# EAGLE design LineBot_2016 (EAGLE 7.4.0)

## Sheet 1 of 9: Spannungsversorgung 3,3V
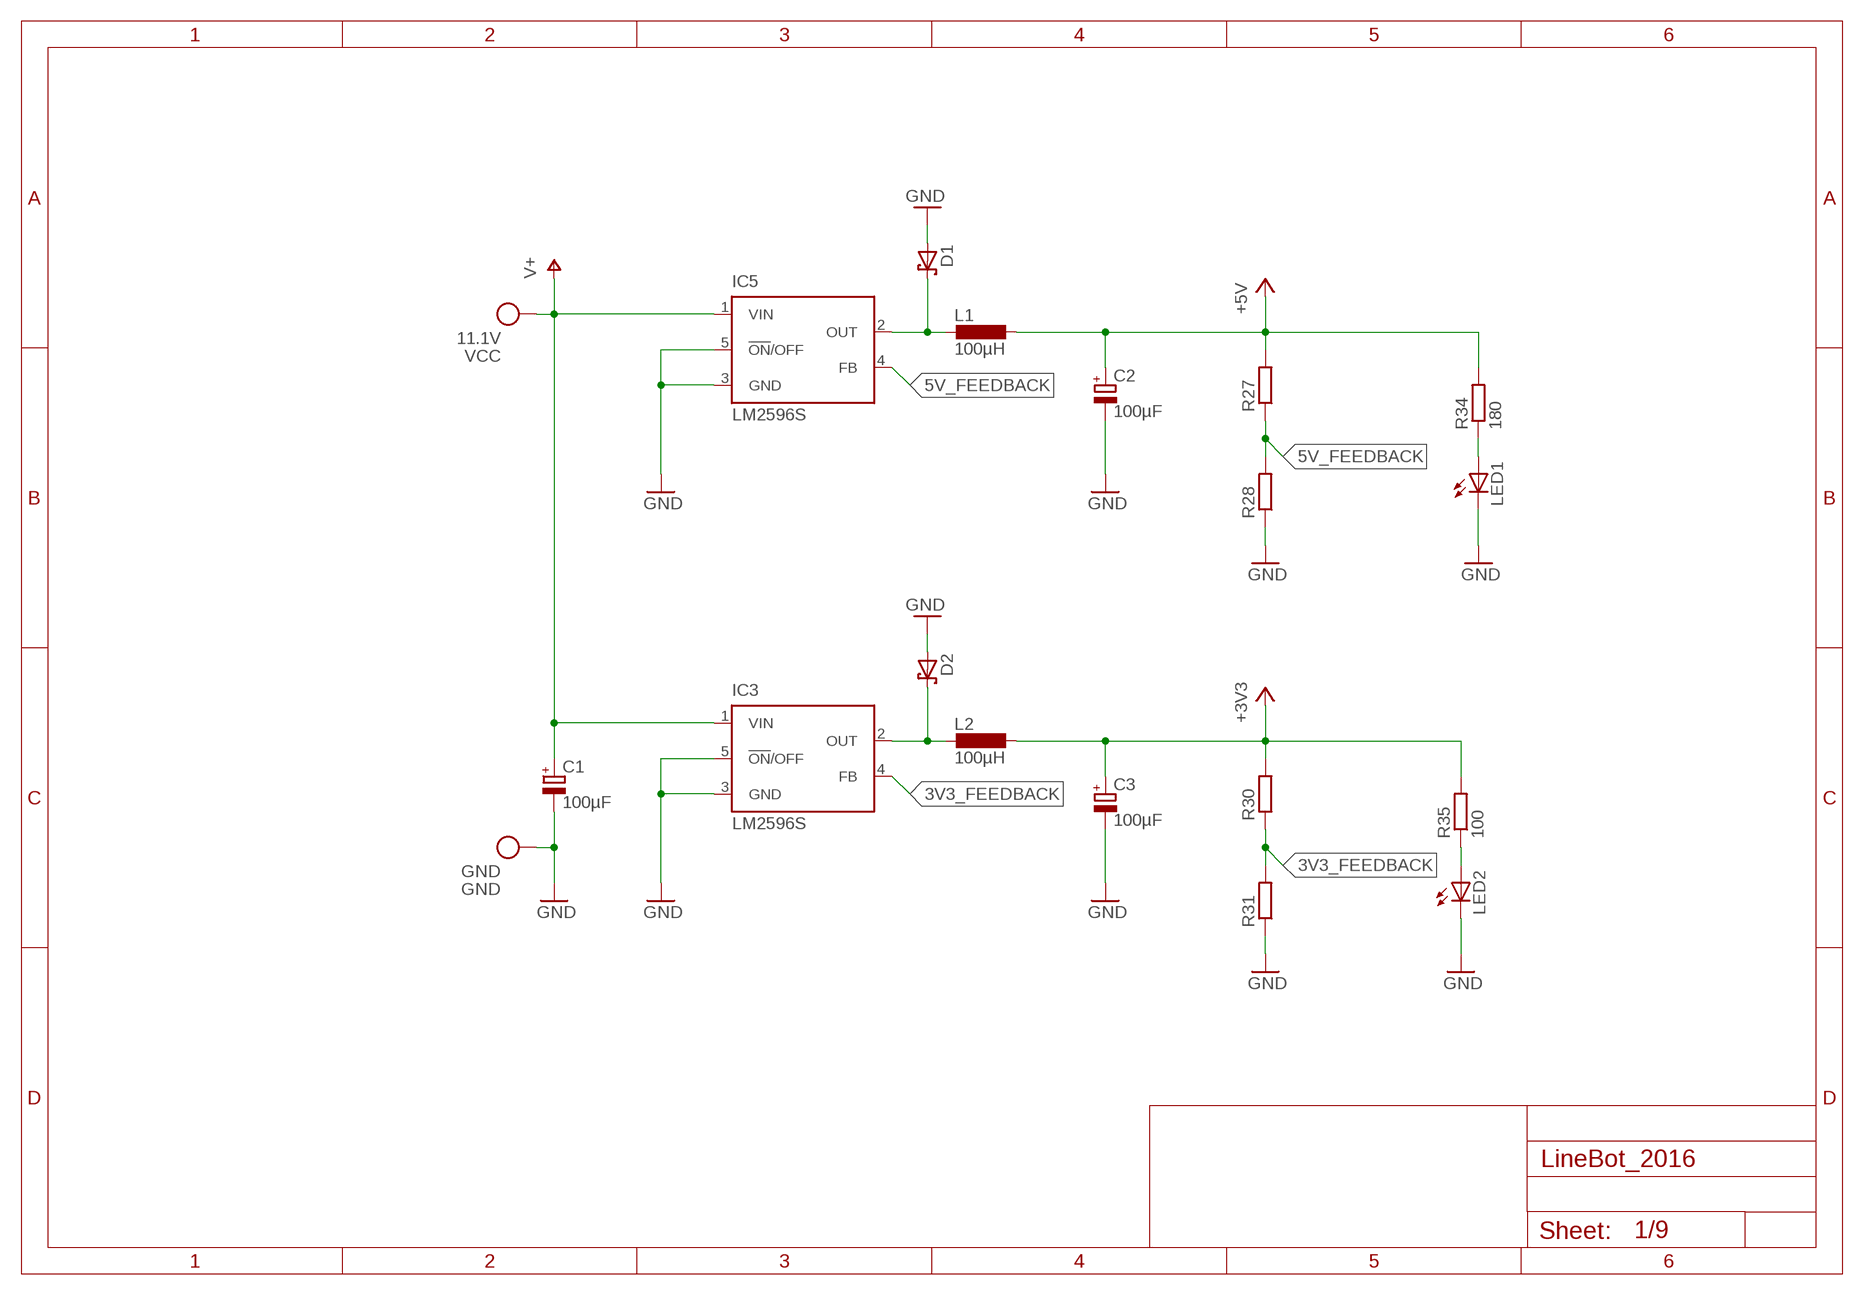
[diagram p0: schematic, sheet 1]

### Parts
C1  100µF  CPOL-EU153CLV-1010  [153CLV-1010]
C2  100µF  CPOL-EU153CLV-0807  [153CLV-0807]
C3  100µF  CPOL-EU153CLV-0807  [153CLV-0807]
D1  SCHOTTKY-DIODESMD  [SMB]
D2  SCHOTTKY-DIODESMD  [SMB]
GND  GND  GOLDKONTAKT_3MM  [GOLDKONTAKT3MM]
IC3  LM2596S  [TO263-5]
IC5  LM2596S  [TO263-5]
L1  100µH  MSS7341  [MSS7341]
L2  100µH  MSS7341  [MSS7341]
LED1  LEDCHIPLED_0805  [CHIPLED_0805]
LED2  LEDCHIPLED_0805  [CHIPLED_0805]
R27  R-EU_R0805  [R0805]
R28  R-EU_R0805  [R0805]
R30  R-EU_R0805  [R0805]
R31  R-EU_R0805  [R0805]
R34  180  R-EU_R0805  [R0805]
R35  100  R-EU_R0805  [R0805]
VCC  11.1V  GOLDKONTAKT_3MM  [GOLDKONTAKT3MM]

### Nets
3V3_FEEDBACK: IC3.4(FB) R30.1 R31.2
5V_FEEDBACK: IC5.4(FB) R27.1 R28.2
+3V3: C3.+ L2.2 R30.2 R35.2 ; also sheet 2,9
+5V: C2.+ L1.2 R27.2 R34.2 ; also sheet 3,6
GND: C1.- C2.- C3.- D1.A D2.A GND.1 IC3.3(GND) IC3.5(!ON!/OFF) IC5.3(GND) IC5.5(!ON!/OFF) LED1.C LED2.C R28.1 R31.1 ; also sheet 2,3,4,5,6,7,8,9
N$20: D1.C IC5.2(OUT) L1.1
N$21: D2.C IC3.2(OUT) L2.1
N$76: LED2.A R35.1
N$77: LED1.A R34.1
V+: C1.+ IC3.1(VIN) IC5.1(VIN) VCC.1 ; also sheet 4,7

## Sheet 2 of 9: Mikrocontroler PIC24FJ256GB110
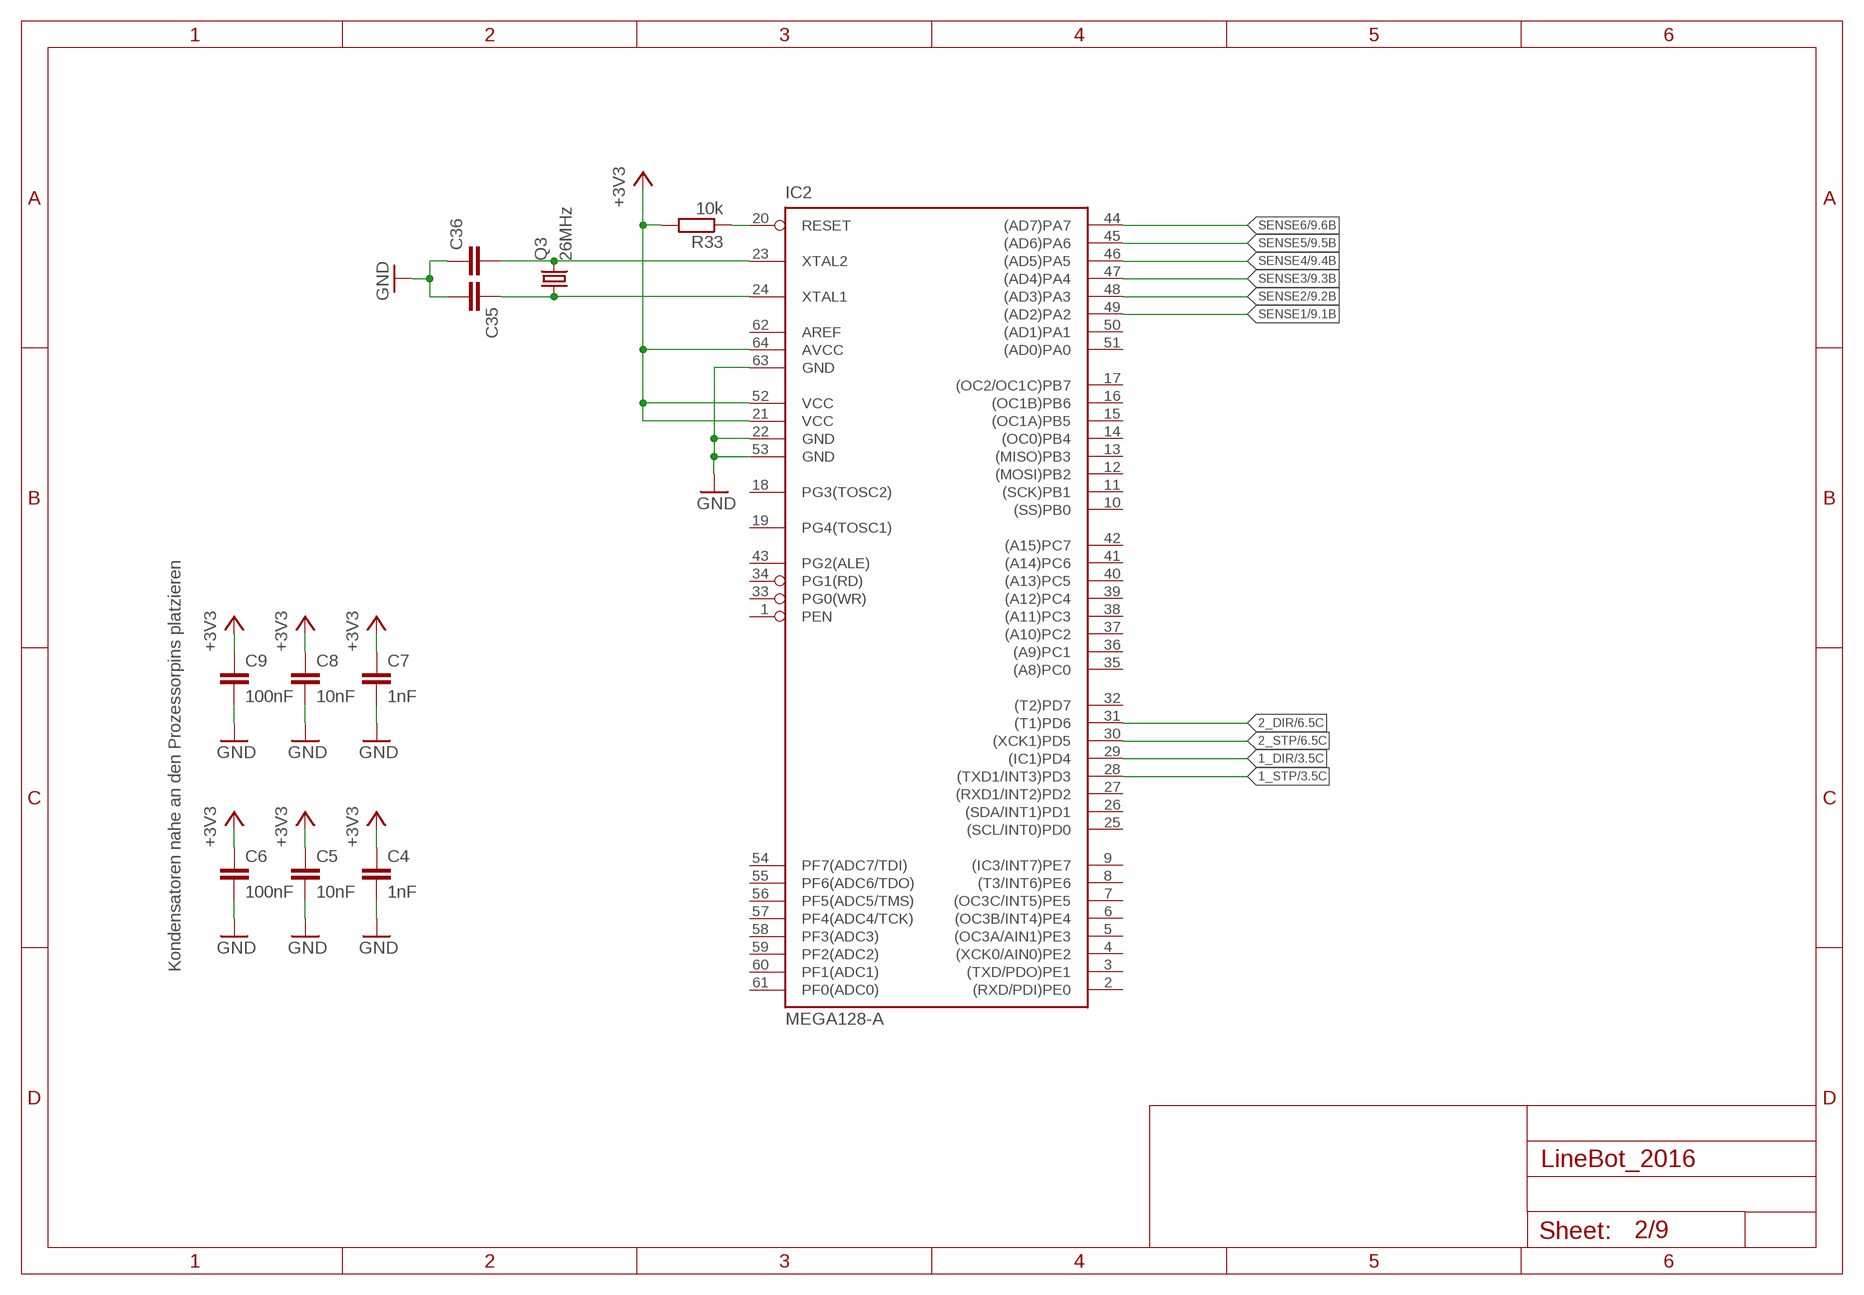
[diagram p1: schematic, sheet 2]

### Parts
C4  1nF  C-EUC0805  [C0805]
C5  10nF  C-EUC0805  [C0805]
C6  100nF  C-EUC0805  [C0805]
C7  1nF  C-EUC0805  [C0805]
C8  10nF  C-EUC0805  [C0805]
C9  100nF  C-EUC0805  [C0805]
C35  C-EUC0805  [C0805]
C36  C-EUC0805  [C0805]
IC2  MEGA128-A  [TQFP64]
Q3  26MHz  CRYSTALHC49U-V  [HC49U-V]
R33  10k  R-EU_R0805  [R0805]

### Nets
1_DIR: IC2.29((IC1)PD4) ; also sheet 3
1_STP: IC2.28((TXD1/INT3)PD3) ; also sheet 3
2_DIR: IC2.31((T1)PD6) ; also sheet 6
2_STP: IC2.30((XCK1)PD5) ; also sheet 6
+3V3: C4.1 C5.1 C6.1 C7.1 C8.1 C9.1 IC2.21(VCC) IC2.52(VCC) IC2.64(AVCC) R33.2 ; also sheet 1,9
GND: C4.2 C5.2 C6.2 C7.2 C8.2 C9.2 C35.2 C36.1 IC2.22(GND) IC2.53(GND) IC2.63(GND) ; also sheet 1,3,4,5,6,7,8,9
N$23: IC2.20(RESET) R33.1
N$24: C36.2 IC2.23(XTAL2) Q3.2
N$25: C35.1 IC2.24(XTAL1) Q3.1
SENSE1: IC2.49((AD2)PA2) ; also sheet 9
SENSE2: IC2.48((AD3)PA3) ; also sheet 9
SENSE3: IC2.47((AD4)PA4) ; also sheet 9
SENSE4: IC2.46((AD5)PA5) ; also sheet 9
SENSE5: IC2.45((AD6)PA6) ; also sheet 9
SENSE6: IC2.44((AD7)PA7) ; also sheet 9
Unconnected: IC2.1(PEN) IC2.2((RXD/PDI)PE0) IC2.3((TXD/PDO)PE1) IC2.4((XCK0/AIN0)PE2) IC2.5((OC3A/AIN1)PE3) IC2.6((OC3B/INT4)PE4) IC2.7((OC3C/INT5)PE5) IC2.8((T3/INT6)PE6) IC2.9((IC3/INT7)PE7) IC2.10((SS)PB0) IC2.11((SCK)PB1) IC2.12((MOSI)PB2) IC2.13((MISO)PB3) IC2.14((OC0)PB4) IC2.15((OC1A)PB5) IC2.16((OC1B)PB6) IC2.17((OC2/OC1C)PB7) IC2.18(PG3(TOSC2)) IC2.19(PG4(TOSC1)) IC2.25((SCL/INT0)PD0) IC2.26((SDA/INT1)PD1) IC2.27((RXD1/INT2)PD2) IC2.32((T2)PD7) IC2.33(PG0(WR)) IC2.34(PG1(RD)) IC2.35((A8)PC0) IC2.36((A9)PC1) IC2.37((A10)PC2) IC2.38((A11)PC3) IC2.39((A12)PC4) IC2.40((A13)PC5) IC2.41((A14)PC6) IC2.42((A15)PC7) IC2.43(PG2(ALE)) IC2.50((AD1)PA1) IC2.51((AD0)PA0) IC2.54(PF7(ADC7/TDI)) IC2.55(PF6(ADC6/TDO)) IC2.56(PF5(ADC5/TMS)) IC2.57(PF4(ADC4/TCK)) IC2.58(PF3(ADC3)) IC2.59(PF2(ADC2)) IC2.60(PF1(ADC1)) IC2.61(PF0(ADC0)) IC2.62(AREF)

### Notes on the sheet
- Kondensatoren nahe an den Prozessorpins platzieren

## Sheet 3 of 9: BLDC Controler Motor 1 (LOGIC)
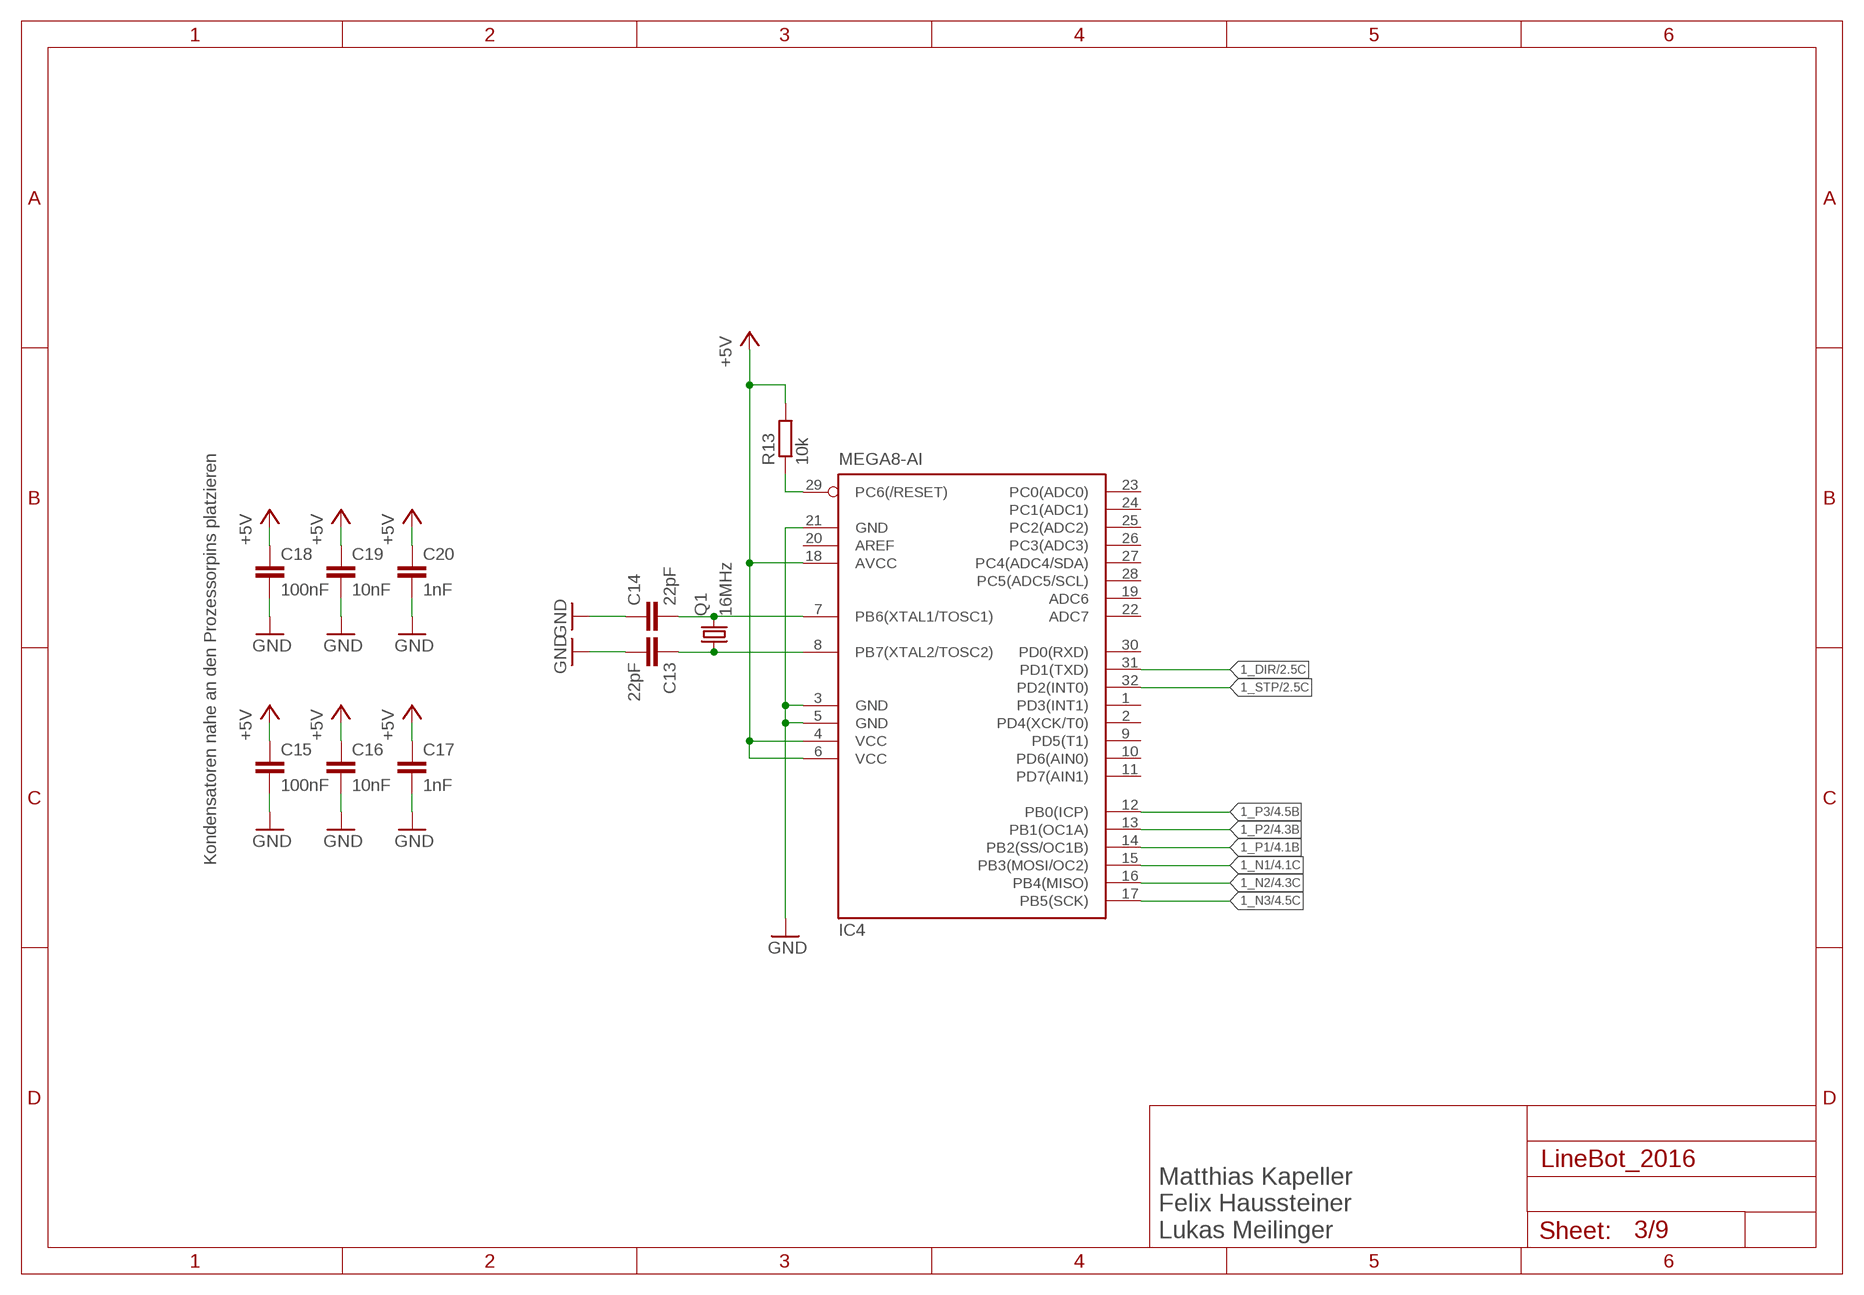
[diagram p2: schematic, sheet 3]

### Parts
C13  22pF  C-EUC0805  [C0805]
C14  22pF  C-EUC0805  [C0805]
C15  100nF  C-EUC0805  [C0805]
C16  10nF  C-EUC0805  [C0805]
C17  1nF  C-EUC0805  [C0805]
C18  100nF  C-EUC0805  [C0805]
C19  10nF  C-EUC0805  [C0805]
C20  1nF  C-EUC0805  [C0805]
IC4  MEGA8-AI  [TQFP32-08]
Q1  16MHz  CRYSTALHC49U-V  [HC49U-V]
R13  10k  R-EU_R0805  [R0805]

### Nets
1_DIR: IC4.31(PD1(TXD)) ; also sheet 2
1_N1: IC4.15(PB3(MOSI/OC2)) ; also sheet 4
1_N2: IC4.16(PB4(MISO)) ; also sheet 4
1_N3: IC4.17(PB5(SCK)) ; also sheet 4
1_P1: IC4.14(PB2(SS/OC1B)) ; also sheet 4
1_P2: IC4.13(PB1(OC1A)) ; also sheet 4
1_P3: IC4.12(PB0(ICP)) ; also sheet 4
1_STP: IC4.32(PD2(INT0)) ; also sheet 2
+5V: C15.1 C16.1 C17.1 C18.1 C19.1 C20.1 IC4.4(VCC) IC4.6(VCC) IC4.18(AVCC) R13.2 ; also sheet 1,6
GND: C13.2 C14.1 C15.2 C16.2 C17.2 C18.2 C19.2 C20.2 IC4.3(GND) IC4.5(GND) IC4.21(GND) ; also sheet 1,2,4,5,6,7,8,9
N$9: C13.1 IC4.8(PB7(XTAL2/TOSC2)) Q1.1
N$10: C14.2 IC4.7(PB6(XTAL1/TOSC1)) Q1.2
N$13: IC4.29(PC6(/RESET)) R13.1
Unconnected: IC4.1(PD3(INT1)) IC4.2(PD4(XCK/T0)) IC4.9(PD5(T1)) IC4.10(PD6(AIN0)) IC4.11(PD7(AIN1)) IC4.19(ADC6) IC4.20(AREF) IC4.22(ADC7) IC4.23(PC0(ADC0)) IC4.24(PC1(ADC1)) IC4.25(PC2(ADC2)) IC4.26(PC3(ADC3)) IC4.27(PC4(ADC4/SDA)) IC4.28(PC5(ADC5/SCL)) IC4.30(PD0(RXD))

### Notes on the sheet
- Kondensatoren nahe an den Prozessorpins platzieren
- Matthias Kapeller
  Felix Haussteiner
  Lukas Meilinger

## Sheet 4 of 9: BLDC Controler Motor 1 (Half H-Bridge)
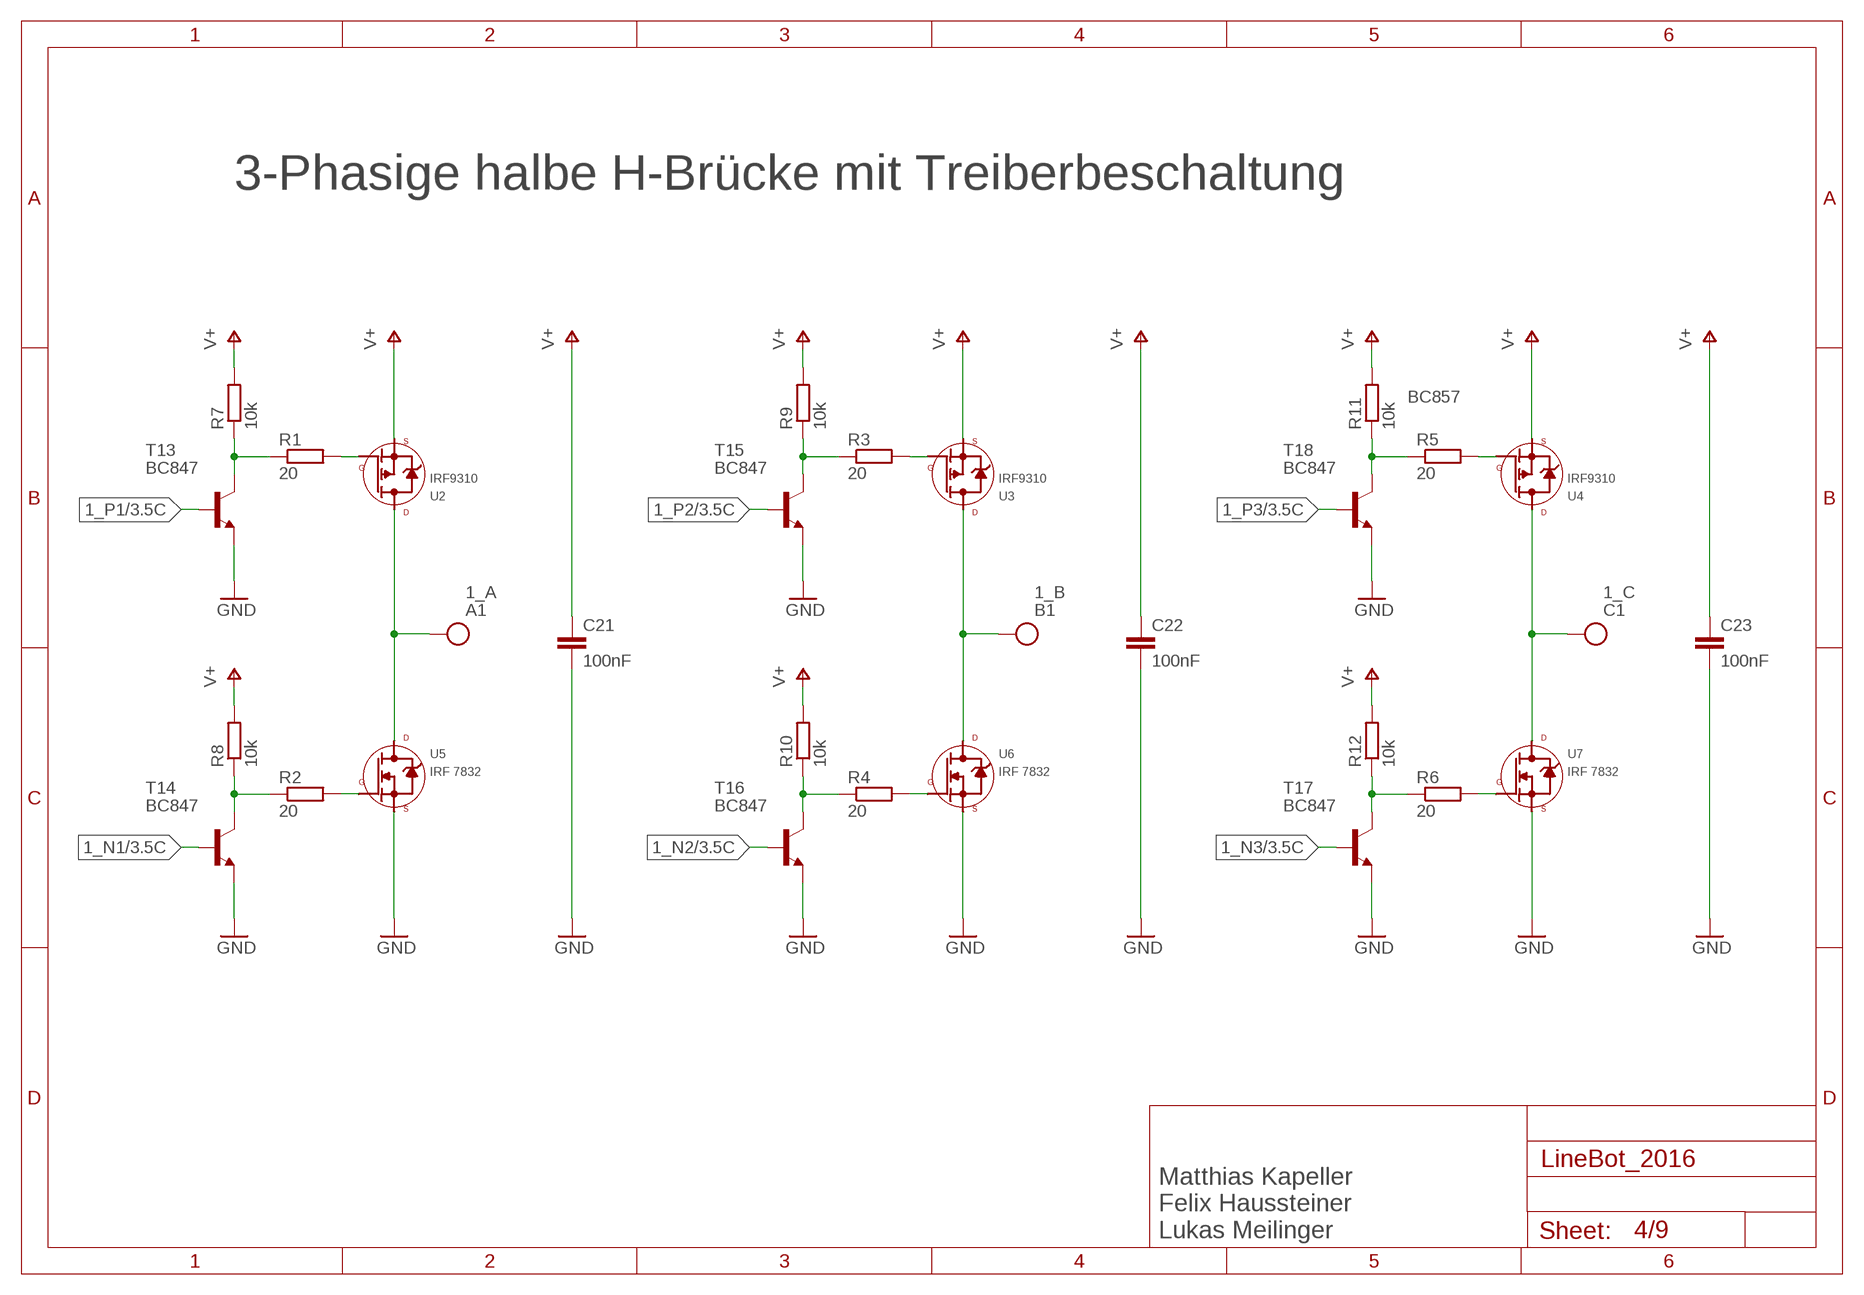
[diagram p3: schematic, sheet 4]

### Parts
1_A  A1  GOLDKONTAKT_3MM  [GOLDKONTAKT3MM]
1_B  B1  GOLDKONTAKT_3MM  [GOLDKONTAKT3MM]
1_C  C1  GOLDKONTAKT_3MM  [GOLDKONTAKT3MM]
C21  100nF  C-EUC1210  [C1210]
C22  100nF  C-EUC1210  [C1210]
C23  100nF  C-EUC1210  [C1210]
R1  20  R-EU_R0805  [R0805]
R2  20  R-EU_R0805  [R0805]
R3  20  R-EU_R0805  [R0805]
R4  20  R-EU_R0805  [R0805]
R5  20  R-EU_R0805  [R0805]
R6  20  R-EU_R0805  [R0805]
R7  10k  R-EU_R0805  [R0805]
R8  10k  R-EU_R0805  [R0805]
R9  10k  R-EU_R0805  [R0805]
R10  10k  R-EU_R0805  [R0805]
R11  10k  R-EU_R0805  [R0805]
R12  10k  R-EU_R0805  [R0805]
T13  BC847  [SOT23]
T14  BC847  [SOT23]
T15  BC847  [SOT23]
T16  BC847  [SOT23]
T17  BC847  [SOT23]
T18  BC847  [SOT23]
U2  IRF9310  [SO8]
U3  IRF9310  [SO8]
U4  IRF9310  [SO8]
U5  IRF7832  [SO8]
U6  IRF7832  [SO8]
U7  IRF7832  [SO8]

### Nets
1_A: 1_A.1 U2.5(D) U2.6#(D) U2.7(D) U2.8(D) U5.5(D) U5.6#(D) U5.7(D) U5.8(D) ; also sheet 5
1_B: 1_B.1 U3.5(D) U3.6#(D) U3.7(D) U3.8(D) U6.5(D) U6.6#(D) U6.7(D) U6.8(D) ; also sheet 5
1_C: 1_C.1 U4.5(D) U4.6#(D) U4.7(D) U4.8(D) U7.5(D) U7.6#(D) U7.7(D) U7.8(D) ; also sheet 5
1_N1: T14.1(B) ; also sheet 3
1_N2: T16.1(B) ; also sheet 3
1_N3: T17.1(B) ; also sheet 3
1_P1: T13.1(B) ; also sheet 3
1_P2: T15.1(B) ; also sheet 3
1_P3: T18.1(B) ; also sheet 3
GND: C21.2 C22.2 C23.2 T13.2(E) T14.2(E) T15.2(E) T16.2(E) T17.2(E) T18.2(E) U5.1(S) U5.2(S) U5.3(S) U6.1(S) U6.2(S) U6.3(S) U7.1(S) U7.2(S) U7.3(S) ; also sheet 1,2,3,5,6,7,8,9
N$3: R1.2 U2.4(G)
N$4: R3.2 U3.4(G)
N$5: R5.2 U4.4(G)
N$6: R6.2 U7.4(G)
N$7: R4.2 U6.4(G)
N$8: R2.2 U5.4(G)
N_1: R2.1 R8.1 T14.3(C)
N_2: R4.1 R10.1 T16.3(C)
N_3: R6.1 R12.1 T17.3(C)
P_1: R1.1 R7.1 T13.3(C)
P_2: R3.1 R9.1 T15.3(C)
P_3: R5.1 R11.1 T18.3(C)
V+: C21.1 C22.1 C23.1 R7.2 R8.2 R9.2 R10.2 R11.2 R12.2 U2.1(S) U2.2(S) U2.3(S) U3.1(S) U3.2(S) U3.3(S) U4.1(S) U4.2(S) U4.3(S) ; also sheet 1,7

### Notes on the sheet
- 3-Phasige halbe H-Brücke mit Treiberbeschaltung
- BC857
- Matthias Kapeller
  Felix Haussteiner
  Lukas Meilinger

## Sheet 5 of 9: BLDC Controler Motor 1 (Sensors)
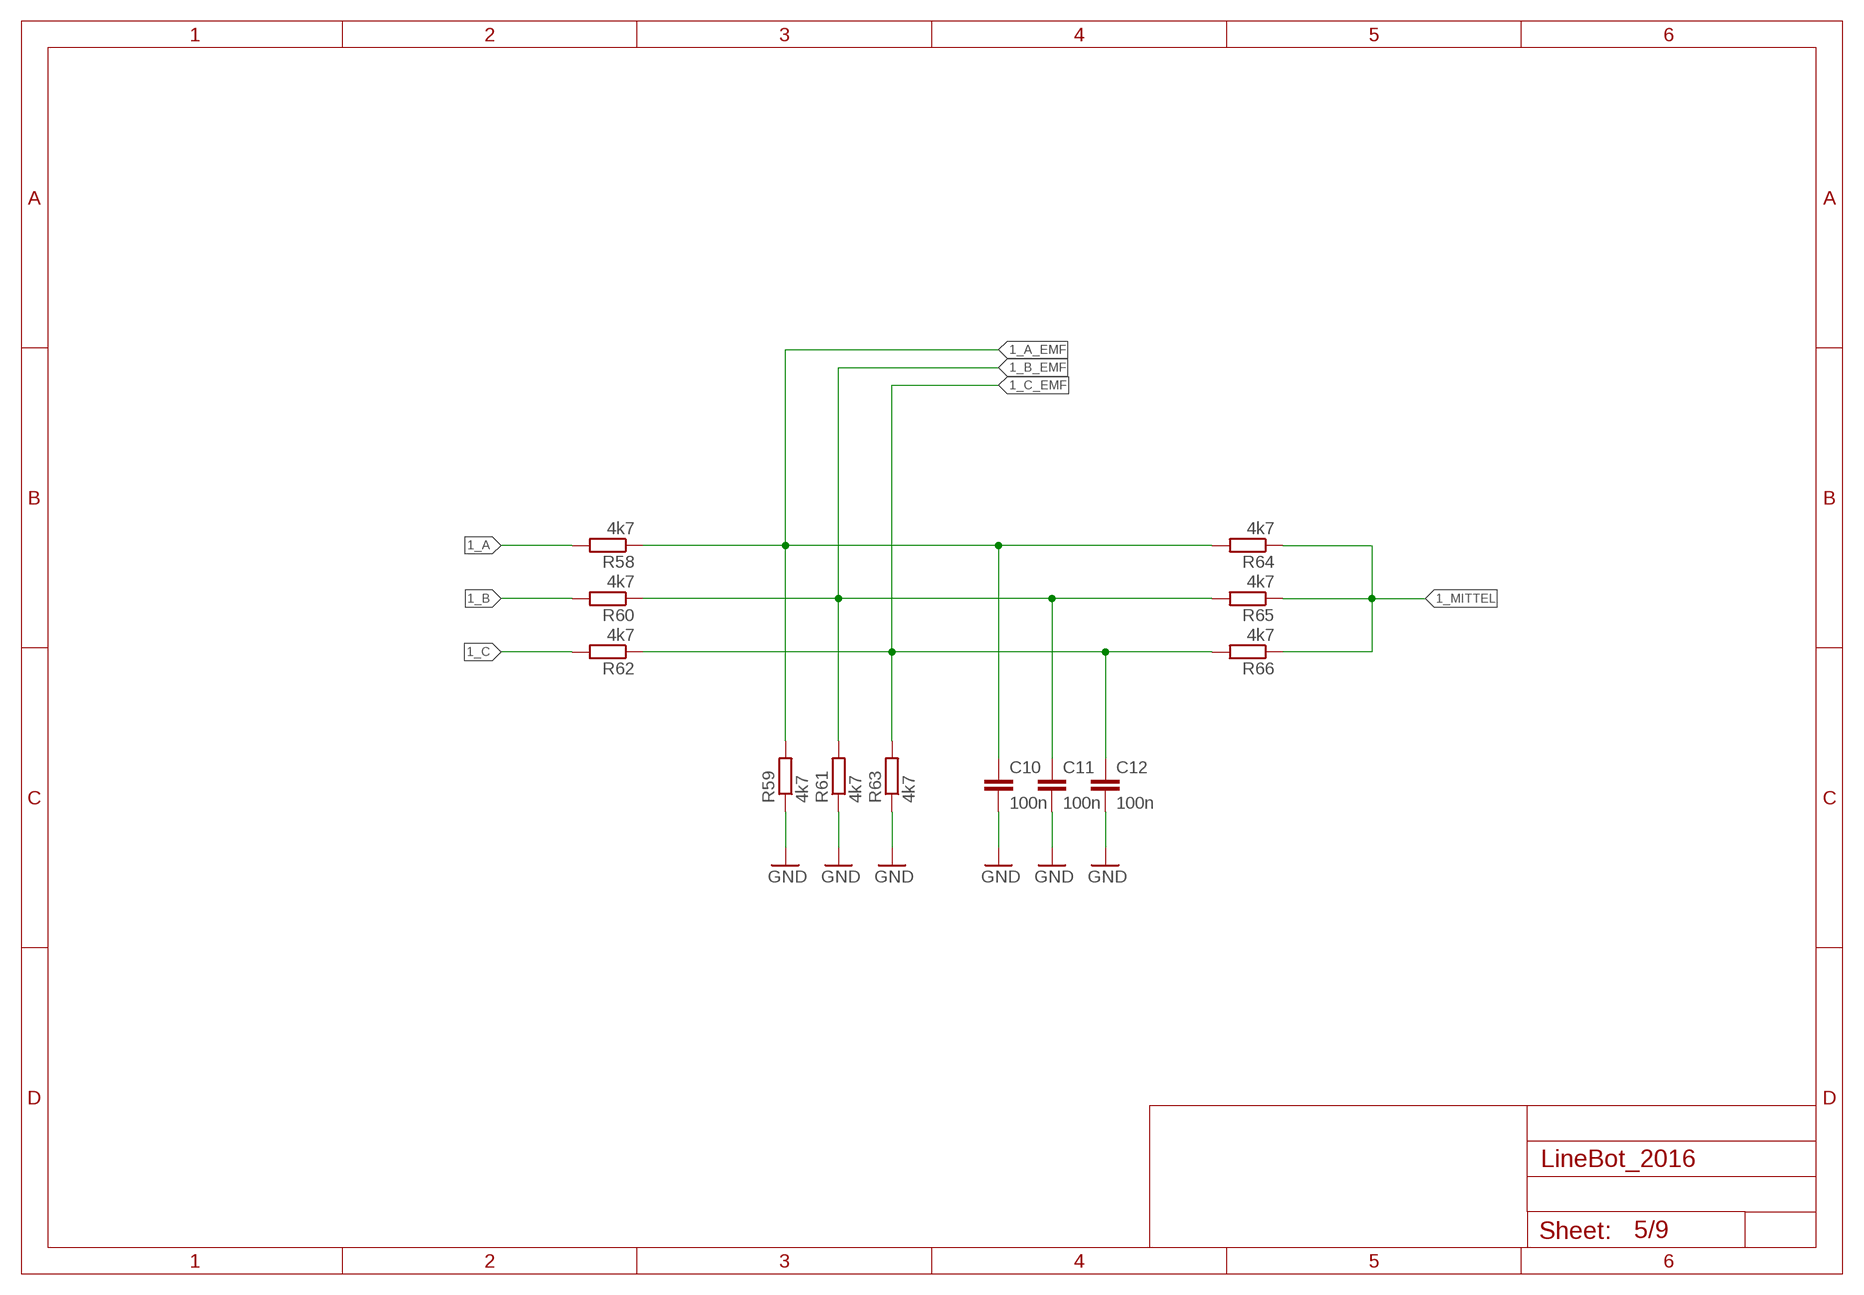
[diagram p4: schematic, sheet 5]

### Parts
C10  100n  C-EUC0805  [C0805]
C11  100n  C-EUC0805  [C0805]
C12  100n  C-EUC0805  [C0805]
R58  4k7  R-EU_R0805  [R0805]
R59  4k7  R-EU_R0805  [R0805]
R60  4k7  R-EU_R0805  [R0805]
R61  4k7  R-EU_R0805  [R0805]
R62  4k7  R-EU_R0805  [R0805]
R63  4k7  R-EU_R0805  [R0805]
R64  4k7  R-EU_R0805  [R0805]
R65  4k7  R-EU_R0805  [R0805]
R66  4k7  R-EU_R0805  [R0805]

### Nets
1_A: R58.2 ; also sheet 4
1_A_EMF: C10.1 R58.1 R59.2 R64.2
1_B: R60.2 ; also sheet 4
1_B_EMF: C11.1 R60.1 R61.2 R65.2
1_C: R62.2 ; also sheet 4
1_C_EMF: C12.1 R62.1 R63.2 R66.2
1_MITTEL: R64.1 R65.1 R66.1
GND: C10.2 C11.2 C12.2 R59.1 R61.1 R63.1 ; also sheet 1,2,3,4,6,7,8,9

## Sheet 6 of 9: BLDC Controler Motor 2
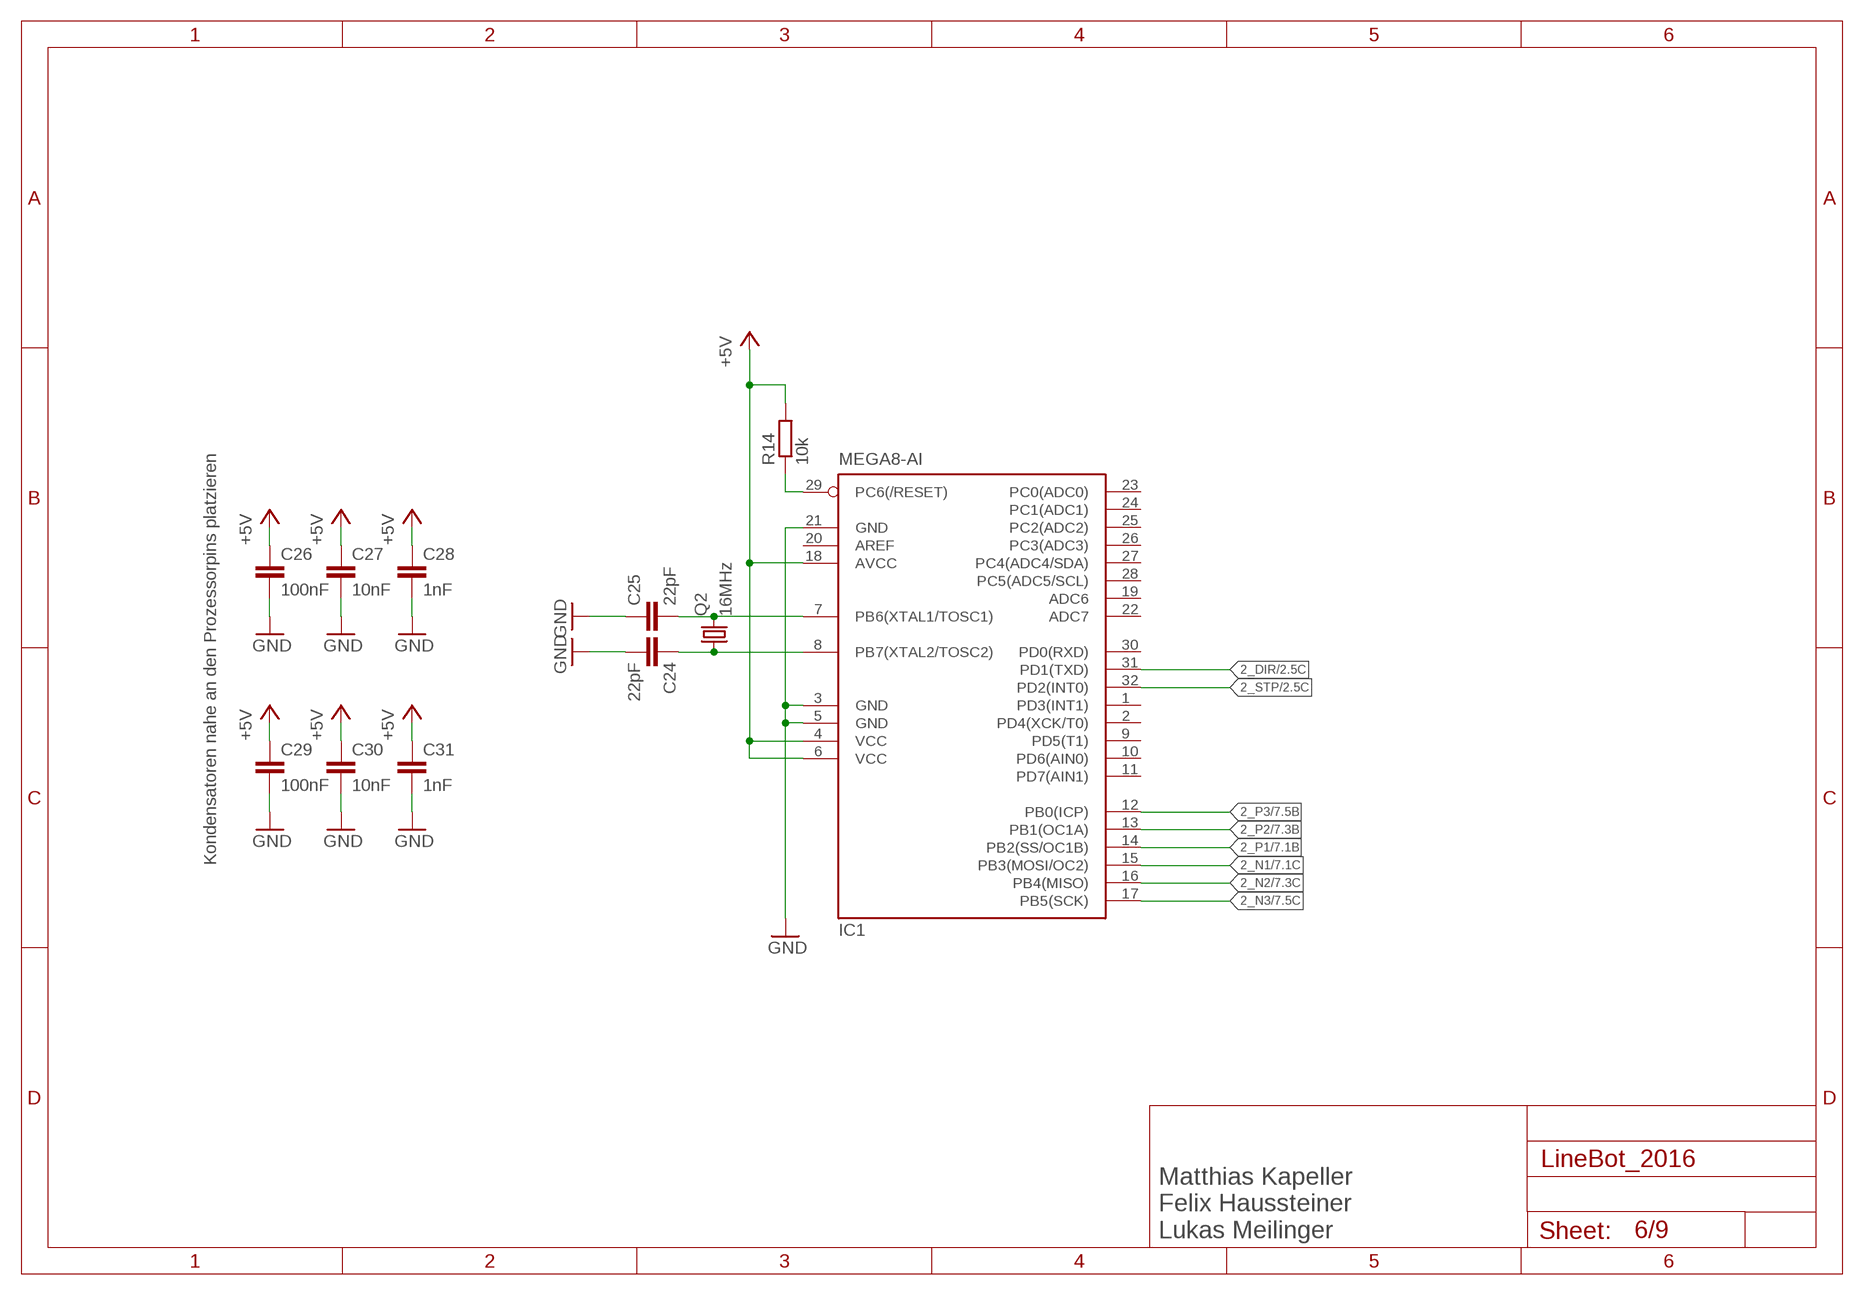
[diagram p5: schematic, sheet 6]

### Parts
C24  22pF  C-EUC0805  [C0805]
C25  22pF  C-EUC0805  [C0805]
C26  100nF  C-EUC0805  [C0805]
C27  10nF  C-EUC0805  [C0805]
C28  1nF  C-EUC0805  [C0805]
C29  100nF  C-EUC0805  [C0805]
C30  10nF  C-EUC0805  [C0805]
C31  1nF  C-EUC0805  [C0805]
IC1  MEGA8-AI  [TQFP32-08]
Q2  16MHz  CRYSTALHC49U-V  [HC49U-V]
R14  10k  R-EU_R0805  [R0805]

### Nets
2_DIR: IC1.31(PD1(TXD)) ; also sheet 2
2_N1: IC1.15(PB3(MOSI/OC2)) ; also sheet 7
2_N2: IC1.16(PB4(MISO)) ; also sheet 7
2_N3: IC1.17(PB5(SCK)) ; also sheet 7
2_P1: IC1.14(PB2(SS/OC1B)) ; also sheet 7
2_P2: IC1.13(PB1(OC1A)) ; also sheet 7
2_P3: IC1.12(PB0(ICP)) ; also sheet 7
2_STP: IC1.32(PD2(INT0)) ; also sheet 2
+5V: C26.1 C27.1 C28.1 C29.1 C30.1 C31.1 IC1.4(VCC) IC1.6(VCC) IC1.18(AVCC) R14.2 ; also sheet 1,3
GND: C24.2 C25.1 C26.2 C27.2 C28.2 C29.2 C30.2 C31.2 IC1.3(GND) IC1.5(GND) IC1.21(GND) ; also sheet 1,2,3,4,5,7,8,9
N$1: C24.1 IC1.8(PB7(XTAL2/TOSC2)) Q2.1
N$2: C25.2 IC1.7(PB6(XTAL1/TOSC1)) Q2.2
N$11: IC1.29(PC6(/RESET)) R14.1
Unconnected: IC1.1(PD3(INT1)) IC1.2(PD4(XCK/T0)) IC1.9(PD5(T1)) IC1.10(PD6(AIN0)) IC1.11(PD7(AIN1)) IC1.19(ADC6) IC1.20(AREF) IC1.22(ADC7) IC1.23(PC0(ADC0)) IC1.24(PC1(ADC1)) IC1.25(PC2(ADC2)) IC1.26(PC3(ADC3)) IC1.27(PC4(ADC4/SDA)) IC1.28(PC5(ADC5/SCL)) IC1.30(PD0(RXD))

### Notes on the sheet
- Kondensatoren nahe an den Prozessorpins platzieren
- Matthias Kapeller
  Felix Haussteiner
  Lukas Meilinger

## Sheet 7 of 9: BLDC Controler Motor 2 (Half H-Bridge)
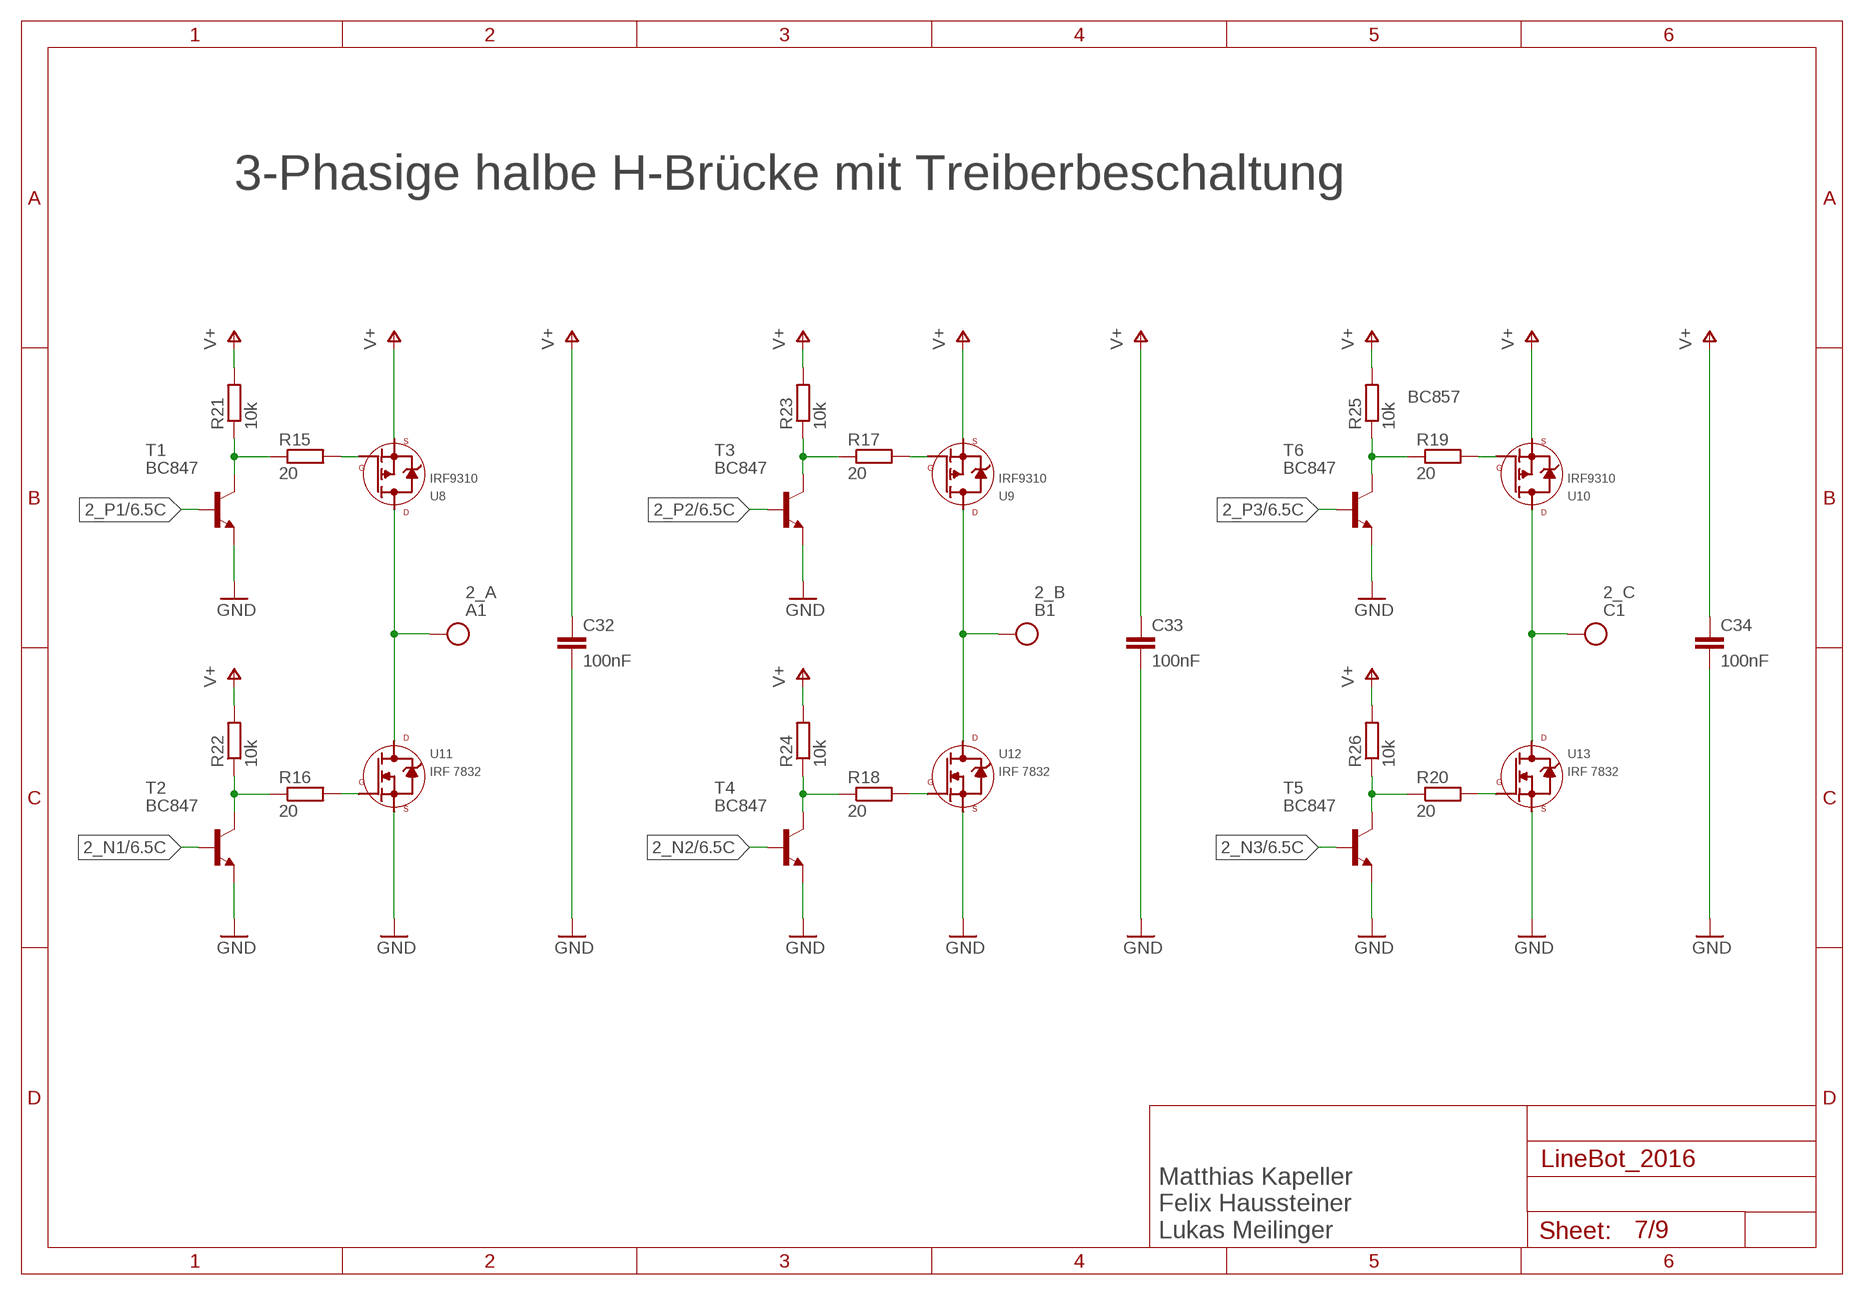
[diagram p6: schematic, sheet 7]

### Parts
2_A  A1  GOLDKONTAKT_3MM  [GOLDKONTAKT3MM]
2_B  B1  GOLDKONTAKT_3MM  [GOLDKONTAKT3MM]
2_C  C1  GOLDKONTAKT_3MM  [GOLDKONTAKT3MM]
C32  100nF  C-EUC1210  [C1210]
C33  100nF  C-EUC1210  [C1210]
C34  100nF  C-EUC1210  [C1210]
R15  20  R-EU_R0805  [R0805]
R16  20  R-EU_R0805  [R0805]
R17  20  R-EU_R0805  [R0805]
R18  20  R-EU_R0805  [R0805]
R19  20  R-EU_R0805  [R0805]
R20  20  R-EU_R0805  [R0805]
R21  10k  R-EU_R0805  [R0805]
R22  10k  R-EU_R0805  [R0805]
R23  10k  R-EU_R0805  [R0805]
R24  10k  R-EU_R0805  [R0805]
R25  10k  R-EU_R0805  [R0805]
R26  10k  R-EU_R0805  [R0805]
T1  BC847  [SOT23]
T2  BC847  [SOT23]
T3  BC847  [SOT23]
T4  BC847  [SOT23]
T5  BC847  [SOT23]
T6  BC847  [SOT23]
U8  IRF9310  [SO8]
U9  IRF9310  [SO8]
U10  IRF9310  [SO8]
U11  IRF7832  [SO8]
U12  IRF7832  [SO8]
U13  IRF7832  [SO8]

### Nets
2_A: 2_A.1 U8.5(D) U8.6#(D) U8.7(D) U8.8(D) U11.5(D) U11.6#(D) U11.7(D) U11.8(D) ; also sheet 8
2_B: 2_B.1 U9.5(D) U9.6#(D) U9.7(D) U9.8(D) U12.5(D) U12.6#(D) U12.7(D) U12.8(D) ; also sheet 8
2_C: 2_C.1 U10.5(D) U10.6#(D) U10.7(D) U10.8(D) U13.5(D) U13.6#(D) U13.7(D) U13.8(D) ; also sheet 8
2_N1: T2.1(B) ; also sheet 6
2_N2: T4.1(B) ; also sheet 6
2_N3: T5.1(B) ; also sheet 6
2_P1: T1.1(B) ; also sheet 6
2_P2: T3.1(B) ; also sheet 6
2_P3: T6.1(B) ; also sheet 6
GND: C32.2 C33.2 C34.2 T1.2(E) T2.2(E) T3.2(E) T4.2(E) T5.2(E) T6.2(E) U11.1(S) U11.2(S) U11.3(S) U12.1(S) U12.2(S) U12.3(S) U13.1(S) U13.2(S) U13.3(S) ; also sheet 1,2,3,4,5,6,8,9
N$12: R15.2 U8.4(G)
N$14: R17.2 U9.4(G)
N$15: R19.2 U10.4(G)
N$16: R20.2 U13.4(G)
N$17: R18.2 U12.4(G)
N$18: R16.2 U11.4(G)
N_4: R16.1 R22.1 T2.3(C)
N_5: R18.1 R24.1 T4.3(C)
N_6: R20.1 R26.1 T5.3(C)
P_4: R17.1 R23.1 T3.3(C)
P_5: R19.1 R25.1 T6.3(C)
P_6: R15.1 R21.1 T1.3(C)
V+: C32.1 C33.1 C34.1 R21.2 R22.2 R23.2 R24.2 R25.2 R26.2 U8.1(S) U8.2(S) U8.3(S) U9.1(S) U9.2(S) U9.3(S) U10.1(S) U10.2(S) U10.3(S) ; also sheet 1,4

### Notes on the sheet
- 3-Phasige halbe H-Brücke mit Treiberbeschaltung
- BC857
- Matthias Kapeller
  Felix Haussteiner
  Lukas Meilinger

## Sheet 8 of 9: BLDC Controler Motor 2 (Sensors)
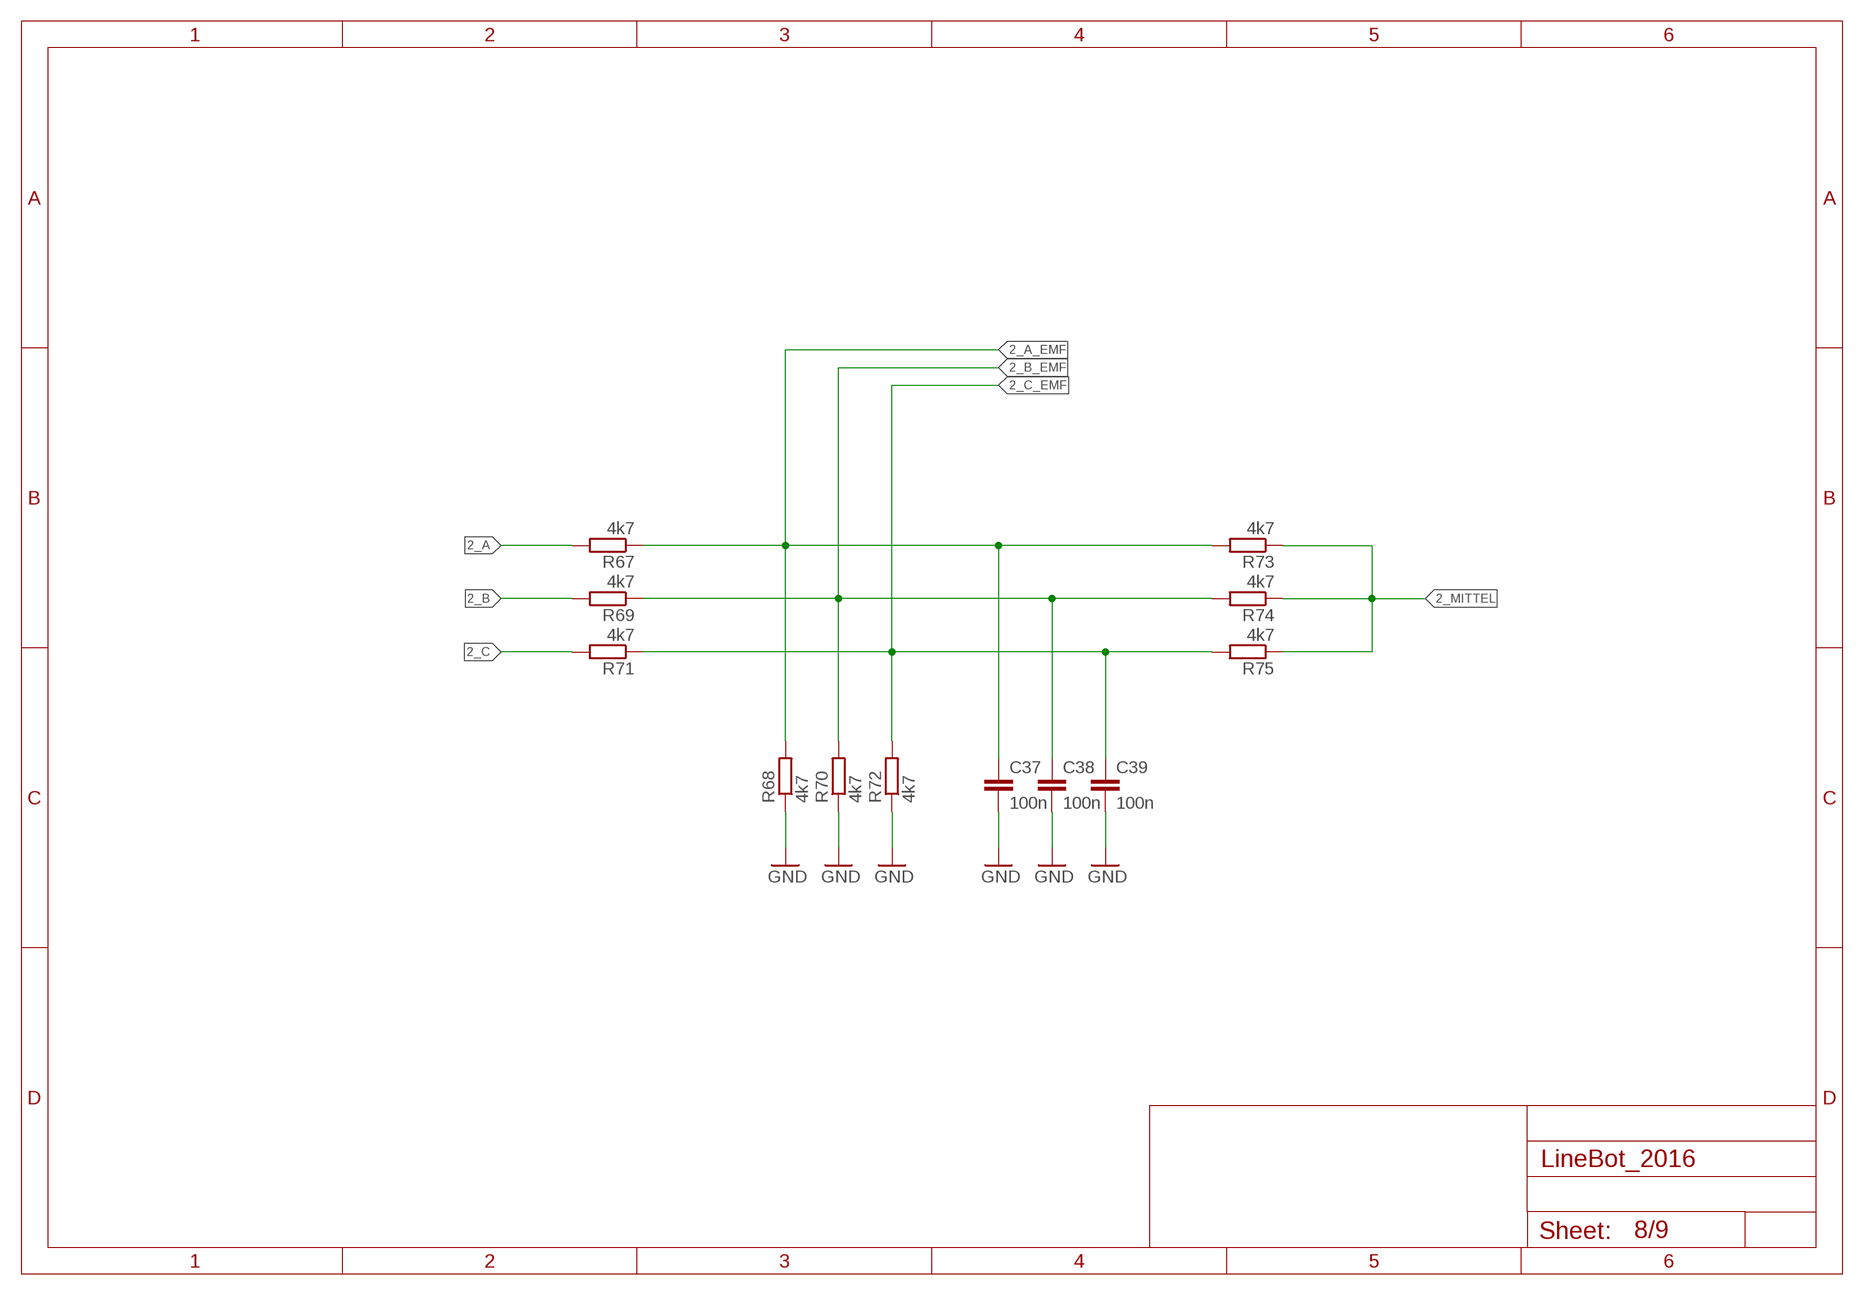
[diagram p7: schematic, sheet 8]

### Parts
C37  100n  C-EUC0805  [C0805]
C38  100n  C-EUC0805  [C0805]
C39  100n  C-EUC0805  [C0805]
R67  4k7  R-EU_R0805  [R0805]
R68  4k7  R-EU_R0805  [R0805]
R69  4k7  R-EU_R0805  [R0805]
R70  4k7  R-EU_R0805  [R0805]
R71  4k7  R-EU_R0805  [R0805]
R72  4k7  R-EU_R0805  [R0805]
R73  4k7  R-EU_R0805  [R0805]
R74  4k7  R-EU_R0805  [R0805]
R75  4k7  R-EU_R0805  [R0805]

### Nets
2_A: R67.2 ; also sheet 7
2_A_EMF: C37.1 R67.1 R68.2 R73.2
2_B: R69.2 ; also sheet 7
2_B_EMF: C38.1 R69.1 R70.2 R74.2
2_C: R71.2 ; also sheet 7
2_C_EMF: C39.1 R71.1 R72.2 R75.2
2_MITTEL: R73.1 R74.1 R75.1
GND: C37.2 C38.2 C39.2 R68.1 R70.1 R72.1 ; also sheet 1,2,3,4,5,6,7,9

## Sheet 9 of 9: Sensoren (Helligkeit)
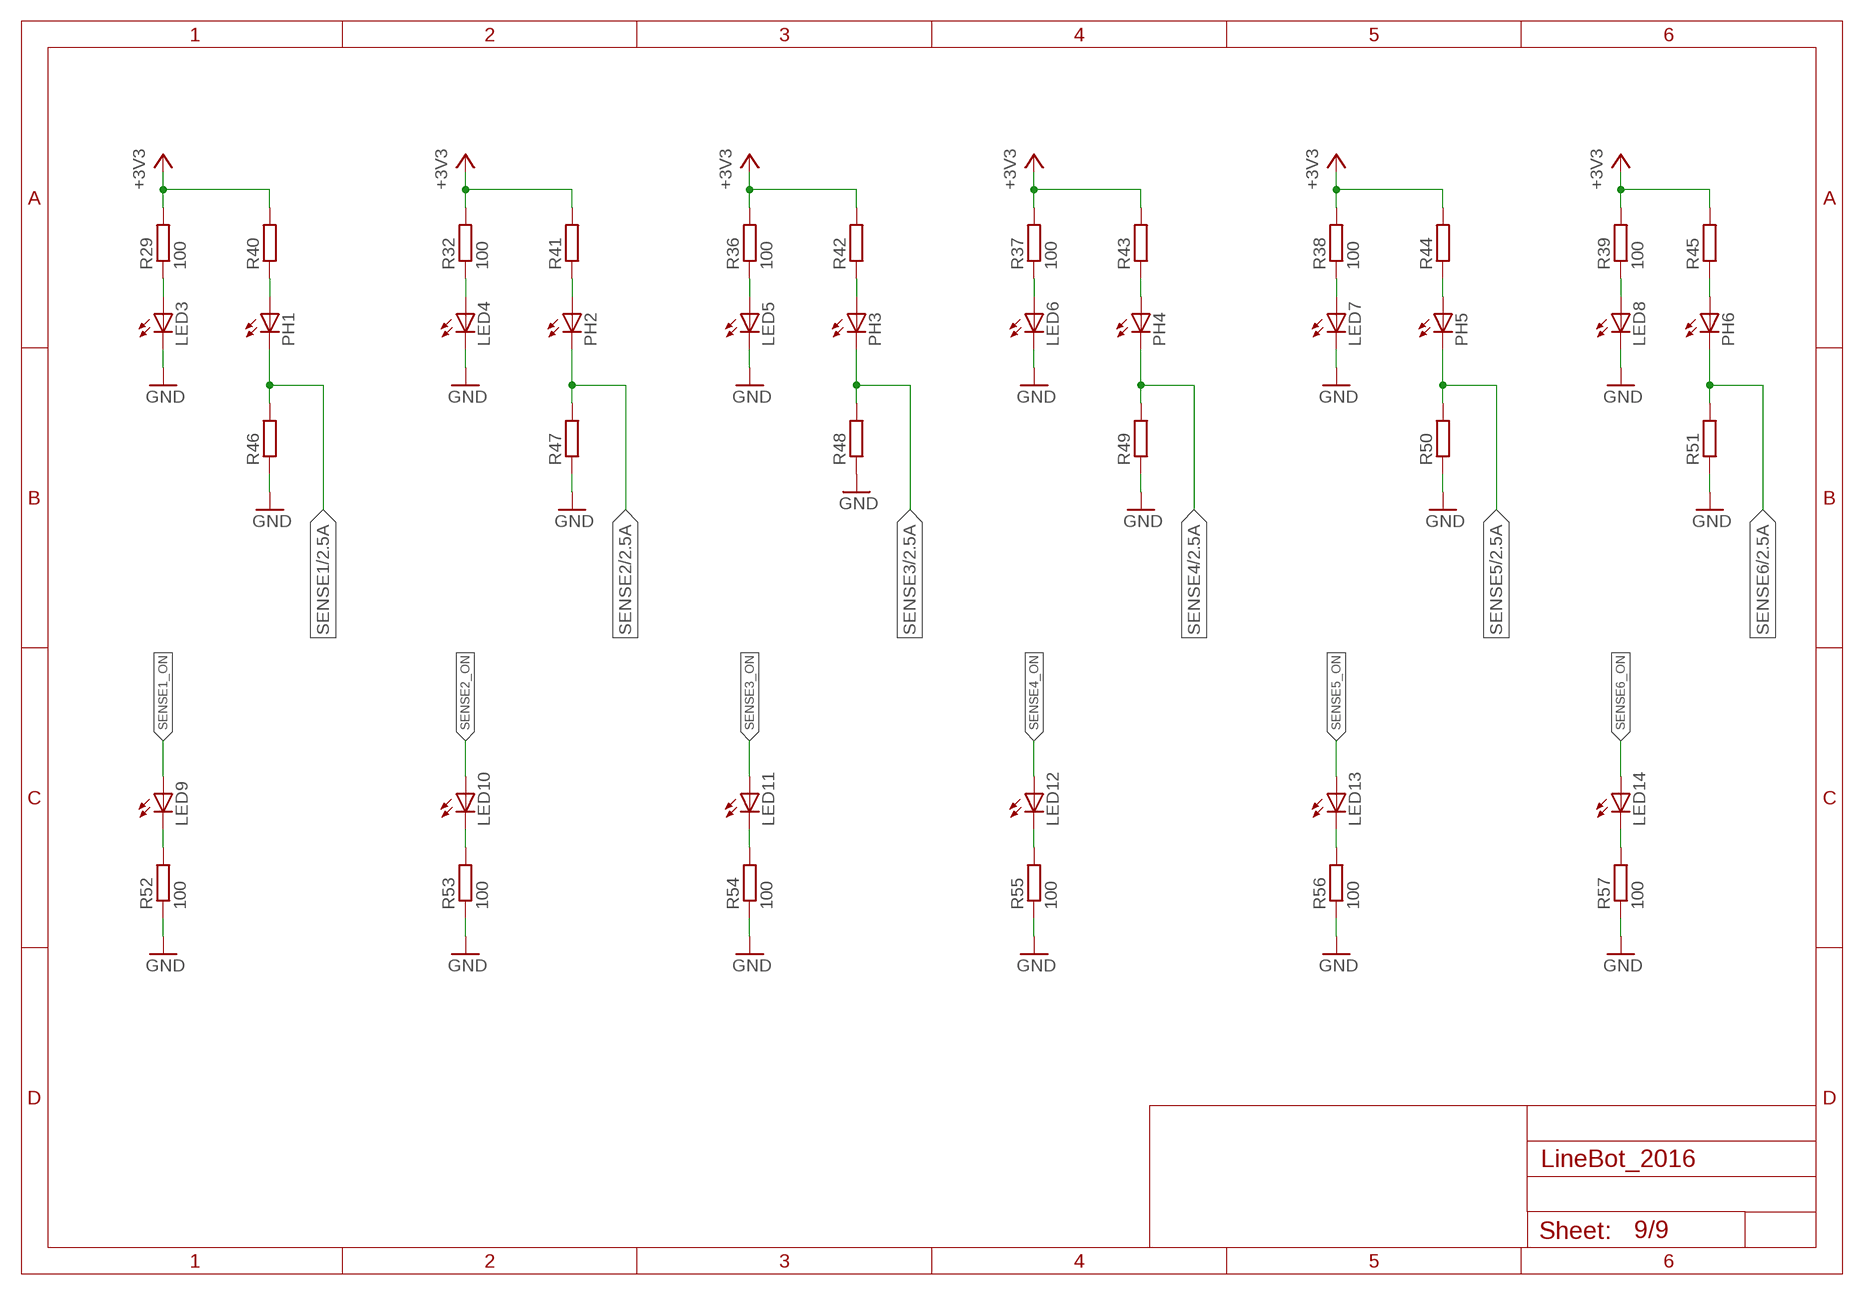
[diagram p8: schematic, sheet 9]

### Parts
LED3  LEDKA-3528ASYC  [KA-3528ASYC]
LED4  LEDKA-3528ASYC  [KA-3528ASYC]
LED5  LEDKA-3528ASYC  [KA-3528ASYC]
LED6  LEDKA-3528ASYC  [KA-3528ASYC]
LED7  LEDKA-3528ASYC  [KA-3528ASYC]
LED8  LEDKA-3528ASYC  [KA-3528ASYC]
LED9  LEDCHIP-LED0805  [CHIP-LED0805]
LED10  LEDCHIP-LED0805  [CHIP-LED0805]
LED11  LEDCHIP-LED0805  [CHIP-LED0805]
LED12  LEDCHIP-LED0805  [CHIP-LED0805]
LED13  LEDCHIP-LED0805  [CHIP-LED0805]
LED14  LEDCHIP-LED0805  [CHIP-LED0805]
PH1  LEDKA-3528ASYC  [KA-3528ASYC]
PH2  LEDKA-3528ASYC  [KA-3528ASYC]
PH3  LEDKA-3528ASYC  [KA-3528ASYC]
PH4  LEDKA-3528ASYC  [KA-3528ASYC]
PH5  LEDKA-3528ASYC  [KA-3528ASYC]
PH6  LEDKA-3528ASYC  [KA-3528ASYC]
R29  100  R-EU_R0805  [R0805]
R32  100  R-EU_R0805  [R0805]
R36  100  R-EU_R0805  [R0805]
R37  100  R-EU_R0805  [R0805]
R38  100  R-EU_R0805  [R0805]
R39  100  R-EU_R0805  [R0805]
R40  R-EU_R0805  [R0805]
R41  R-EU_R0805  [R0805]
R42  R-EU_R0805  [R0805]
R43  R-EU_R0805  [R0805]
R44  R-EU_R0805  [R0805]
R45  R-EU_R0805  [R0805]
R46  R-EU_R0805  [R0805]
R47  R-EU_R0805  [R0805]
R48  R-EU_R0805  [R0805]
R49  R-EU_R0805  [R0805]
R50  R-EU_R0805  [R0805]
R51  R-EU_R0805  [R0805]
R52  100  R-EU_R0805  [R0805]
R53  100  R-EU_R0805  [R0805]
R54  100  R-EU_R0805  [R0805]
R55  100  R-EU_R0805  [R0805]
R56  100  R-EU_R0805  [R0805]
R57  100  R-EU_R0805  [R0805]

### Nets
+3V3: R29.2 R32.2 R36.2 R37.2 R38.2 R39.2 R40.2 R41.2 R42.2 R43.2 R44.2 R45.2 ; also sheet 1,2
GND: LED3.C LED4.C LED5.C LED6.C LED7.C LED8.C R46.1 R47.1 R48.1 R49.1 R50.1 R51.1 R52.1 R53.1 R54.1 R55.1 R56.1 R57.1 ; also sheet 1,2,3,4,5,6,7,8
N$19: LED3.A R29.1
N$22: LED4.A R32.1
N$78: LED5.A R36.1
N$79: LED6.A R37.1
N$80: LED7.A R38.1
N$81: LED8.A R39.1
N$82: PH1.A R40.1
N$83: PH2.A R41.1
N$84: PH3.A R42.1
N$85: PH4.A R43.1
N$86: PH5.A R44.1
N$87: PH6.A R45.1
N$89: LED9.C R52.2
N$90: LED10.C R53.2
N$91: LED11.C R54.2
N$92: LED12.C R55.2
N$93: LED13.C R56.2
N$94: LED14.C R57.2
SENSE1: PH1.C R46.2 ; also sheet 2
SENSE1_ON: LED9.A
SENSE2: PH2.C R47.2 ; also sheet 2
SENSE2_ON: LED10.A
SENSE3: PH3.C R48.2 ; also sheet 2
SENSE3_ON: LED11.A
SENSE4: PH4.C R49.2 ; also sheet 2
SENSE4_ON: LED12.A
SENSE5: PH5.C R50.2 ; also sheet 2
SENSE5_ON: LED13.A
SENSE6: PH6.C R51.2 ; also sheet 2
SENSE6_ON: LED14.A

## Library data of the parts
1_A 1_B 1_C 2_A 2_B 2_C GND VCC = Connectors:GOLDKONTAKT_3MM
C1-C3 = rcl:CPOL-EU: POLARIZED CAPACITOR, European symbol
C4-C39 = rcl:C-EU: CAPACITOR, European symbol
D1 D2 = diode:SCHOTTKY-DIODE: Schottky Diode
IC1 IC4 = atmel:MEGA8: MICROCONTROLLER 8 Kbytes FLASH, 1 kbytes SRAM, 512 bytes EEPROM, USART, 6-channel 10 bit ADC, 2-channel 8 bit ADC Pin compatible with Atmega48, ATMega88, ATMega168 Source: avr.lbr; MPN: ATMEGA8-16AU; OC_FARNELL: 9171371; OC_NEWARK: 73M8863
IC2 = atmel:MEGA128: MICROCONTROLLER 128 Kbytes FLASH 4 Kbytes SRAM 4 Kbytes EEPROM DUAL USART 8-channel 10 bit ADC Source: avr.lbr; MPN: ATMEGA128-16AU; OC_FARNELL: 9171118; OC_NEWARK: 95K7364
IC3 IC5 = national-semiconductor:LM2596: SIMPLE SWITCHER® Power Converter 150 kHz 3A Step-Down Voltage Regulator Source: http://www.national.com/ds/LM/LM2596.pdf; MF: NATIONAL SEMICONDUCTOR; MPN: LM2596S-ADJ/NOPB; OC_FARNELL: 9494367; OC_NEWARK: 41K3842
L1 L2 = inductor-coilcraft:MSS7341: Shielded Power Inductors Package 6.6 × 6.6 mm x 4.1 mm high Source: http://www.farnell.com/datasheets/1681958.pdf
LED1-LED14 PH1-PH6 = led:LED: LED OSRAM: - CHIPLED LG R971, LG N971, LY N971, LG Q971, LY Q971, LO R971, LY R971 LH N974, LH R974 LS Q976, LO Q976, LY Q976 LO Q996 - Hyper CHIPLED LW Q18S LB Q993, LB Q99A, LB R99A - SideLED LS A670, LO A670, LY A670, LG A670, LP A670 LB A673, LV A673, LT A673, LW A673 LH A674 LY A675 LS A676, LA A676, LO A676, LY A676, LW A676 LS A679, LY A679, LG A679 - Hyper Micro SIDELED® LS Y876, LA Y876, LO Y876, LY Y876 LT Y87S - SmartLED LW L88C, LW L88S LB L89C, LB L89S, LG L890 LS L89K, LO L89K, LY L89K LS L896, LA L896, LO L896, LY L896 - TOPLED LS T670, LO T670, LY T670, LG T670, LP T670 LSG T670, LSP T670, LSY T670, LOP T670, LYG T670 LG T671, LOG T671, LSG T671 LB T673, LV T673, LT T673, LW T673 LH T674 LS T676, LA T676, LO T676, LY T676, LB T676, LH T676, LSB T676, LW T676 LB T67C, LV T67C, LT T67C, LS T67K, LO T67K, LY T67K, LW E67C LS E67B, LA E67B, LO E67B, LY E67B, LB E67C, LV E67C, LT E67C LW T67C LS T679, LY T679, LG T679 LS T770, LO T770, LY T770, LG T770, LP T770 LB T773, LV T773, LT T773, LW T773 LH T774 LS E675, LA E675, LY E675, LS T675 LS T776, LA T776, LO T776, LY T776, LB T776 LHGB T686 LT T68C, LB T68C - Hyper Mini TOPLED® LB M676 - Mini TOPLED Santana® LG M470 LS M47K, LO M47K, LY M47K Source: http://www.osram.convergy.de LUXEON: - LUMILED® LXK2-PW12-R00, LXK2-PW12-S00, LXK2-PW14-U00, LXK2-PW14-V00 LXK2-PM12-R00, LXK2-PM12-S00, LXK2-PM14-U00 LXK2-PE12-Q00, LXK2-PE12-R00, LXK2-PE12-S00, LXK2-PE14-T00, LXK2-PE14-U00 LXK2-PB12-K00, LXK2-PB12-L00, LXK2-PB12-M00, LXK2-PB14-N00, LXK2-PB14-P00, LXK2-PB14-Q00 LXK2-PR12-L00, LXK2-PR12-M00, LXK2-PR14-Q00, LXK2-PR14-R00 LXK2-PD12-Q00, LXK2-PD12-R00, LXK2-PD12-S00 LXK2-PH12-R00, LXK2-PH12-S00 LXK2-PL12-P00, LXK2-PL12-Q00, LXK2-PL12-R00 Source: www.luxeon.com KINGBRIGHT: KA-3528ASYC Source: www.kingbright.com
Q1-Q3 = crystal:CRYSTAL: CRYSTAL; OC_FARNELL: 1666969; OC_NEWARK: unknown
R1-R75 = rcl:R-EU_: RESISTOR, European symbol
T1-T6 T13-T18 = transistor:BC847: NPN TRANSISTOR
U2-U4 U8-U10 = IRF:IRF9310
U5-U7 U11-U13 = IRF:IRF7832

## Board
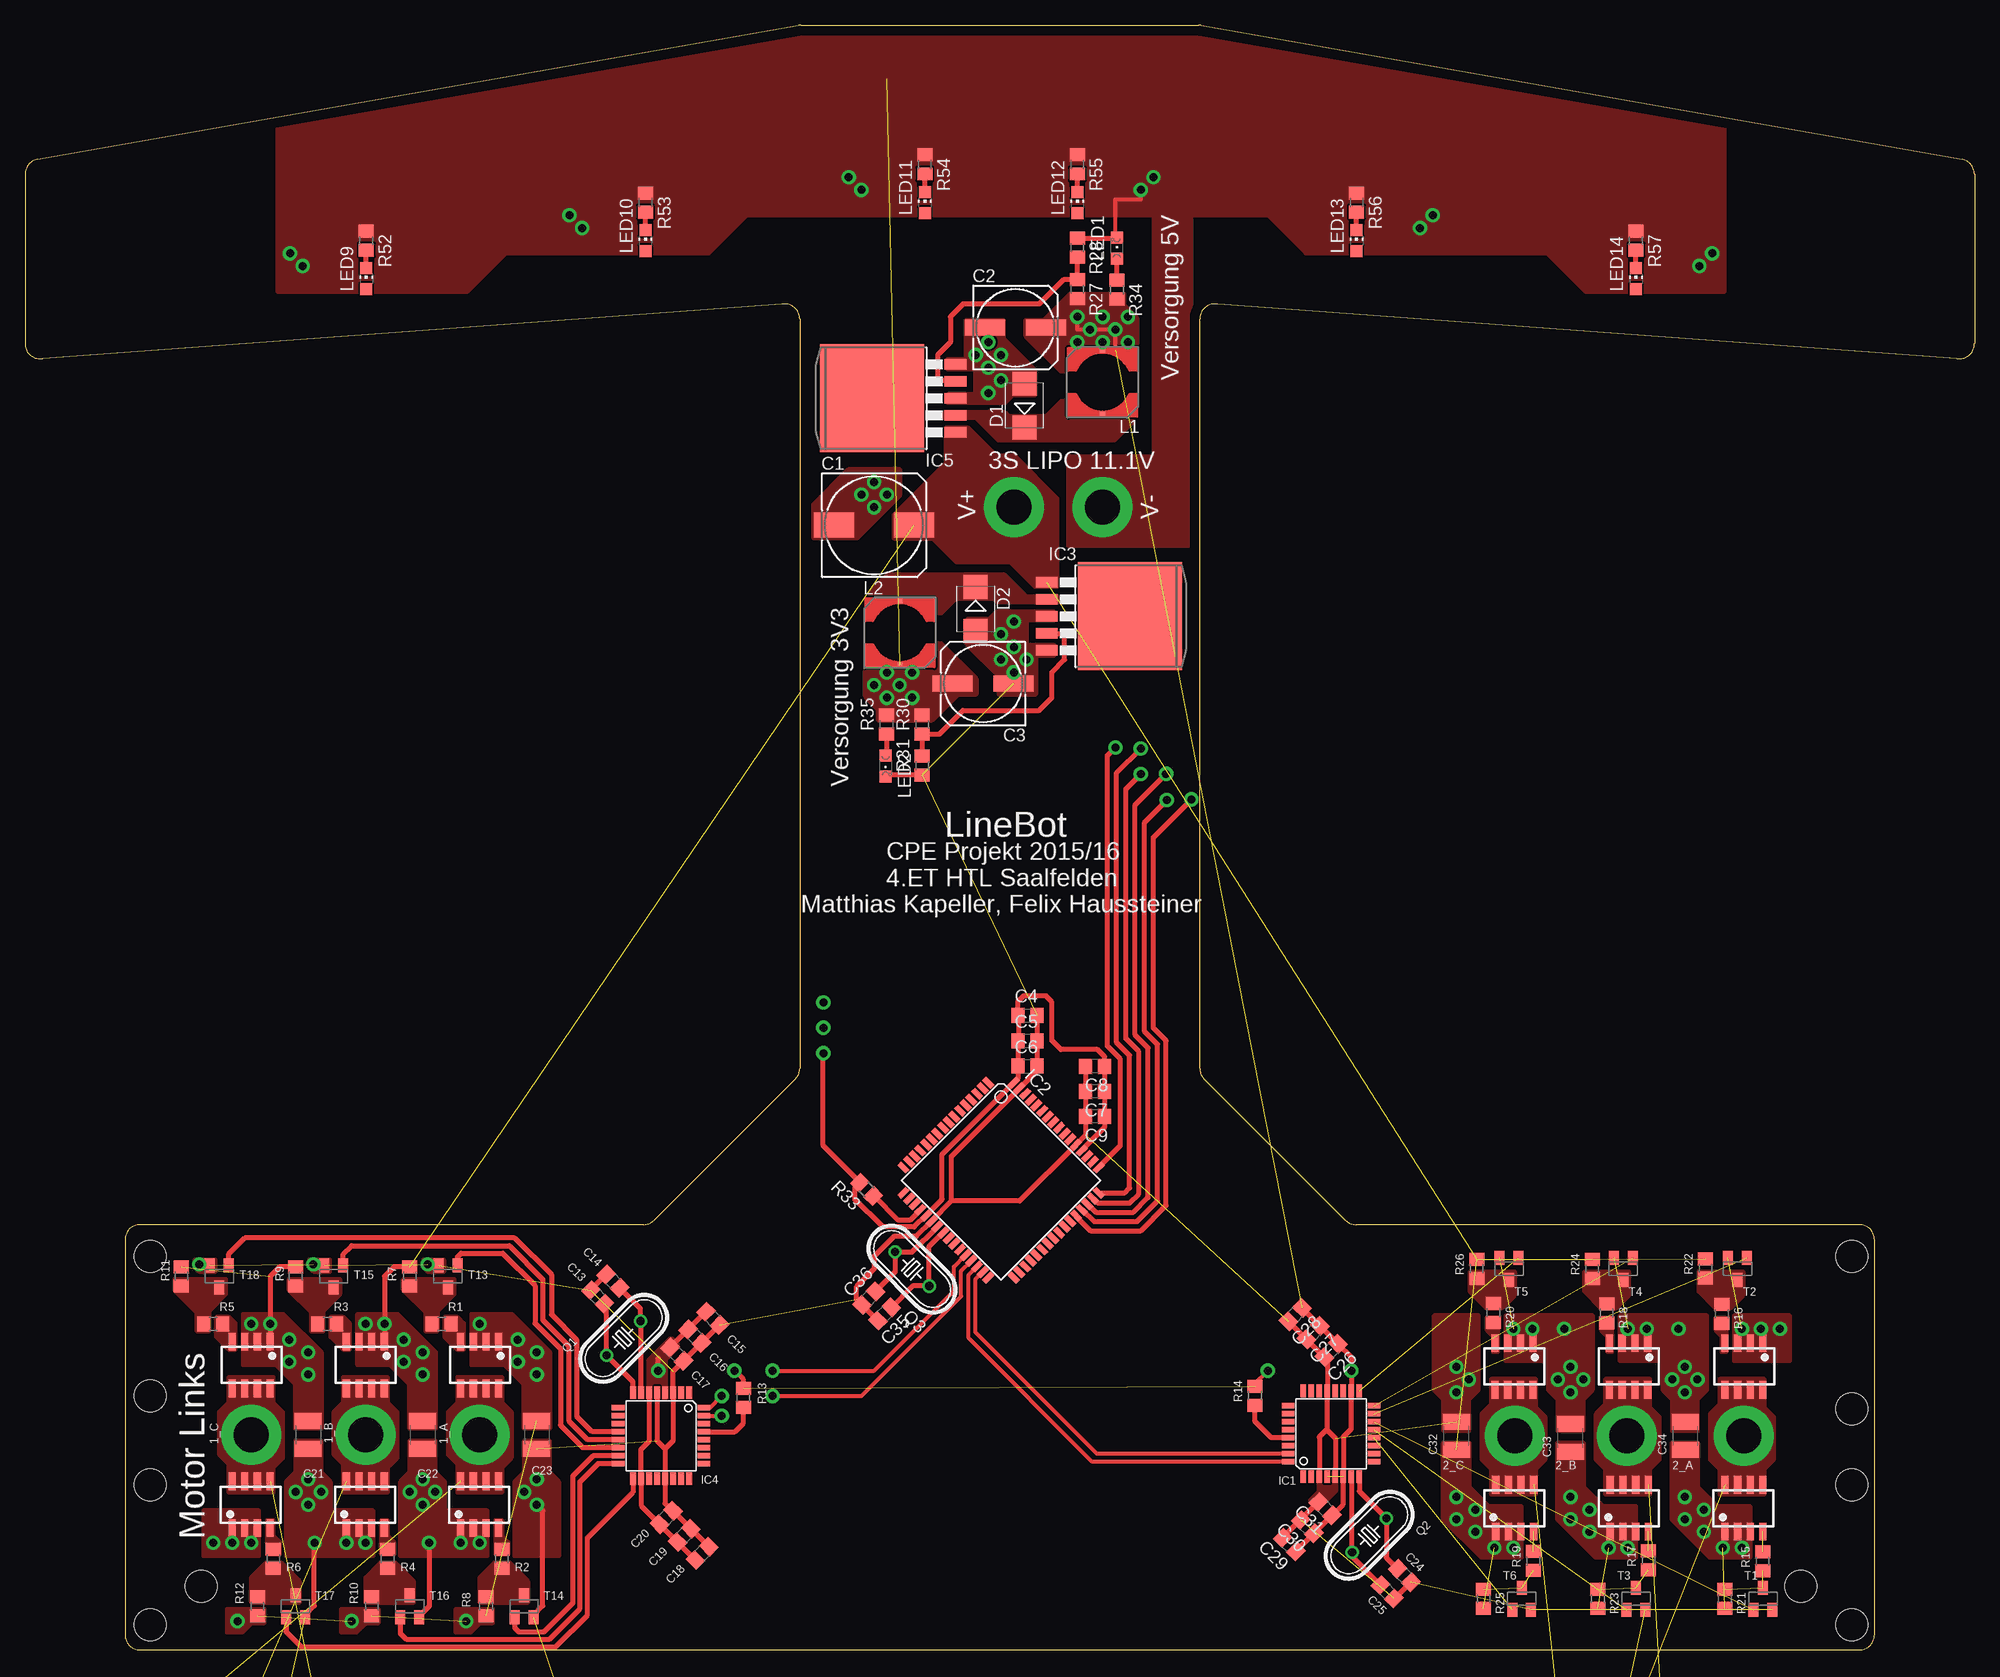
[diagram p9: board, top side]
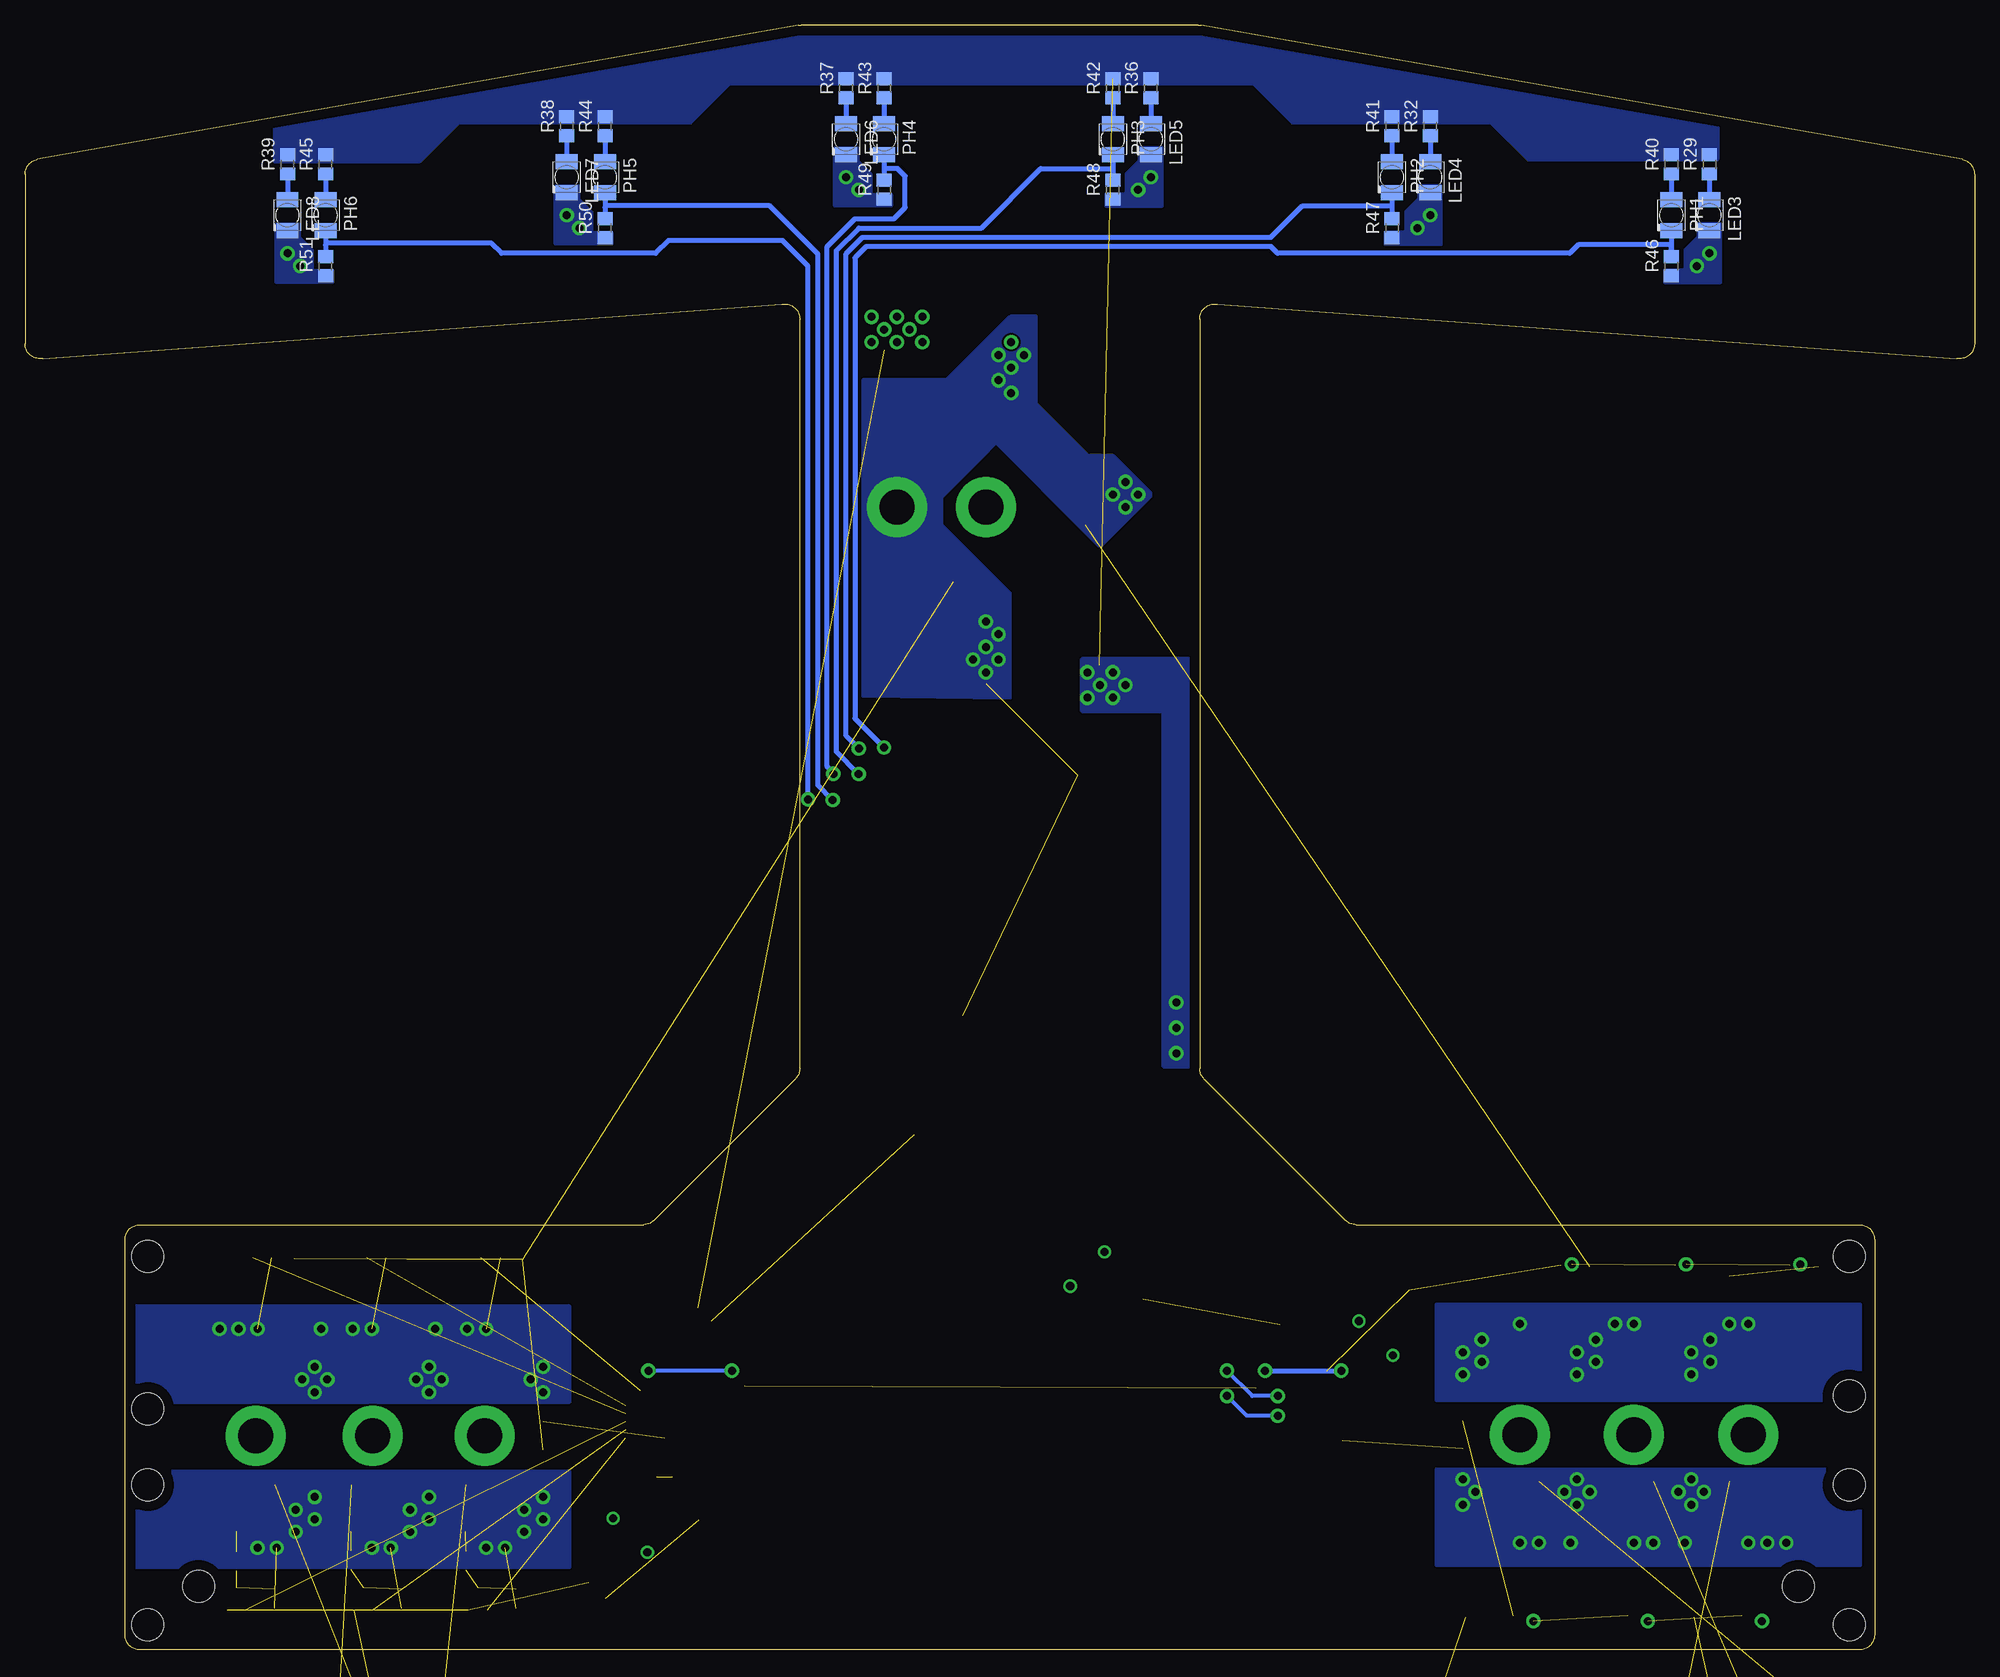
[diagram p10: board, bottom side, seen from below]

Size 195 x 162.54 mm. Coordinates in mm from the lower left corner, seen from the top.
Outline: 77.06,57.1 62.94,42.98 arc-45 61.88,42.54 11.5,42.54 arc90 10,41.04 10,1.5 arc90 11.5,0 183.5,0 arc90 185,1.5 185,41.04 arc90 183.5,42.54 133.12,42.54 arc-45 132.06,42.98 117.94,57.1 arc-45 117.5,58.16 117.5,133.13 arc-100 119.26,134.61 193.24,129.19 arc100 195,130.66 195,147.62 arc80 193.76,149.09 117.63,162.52 arc10 117.37,162.54 77.63,162.54 arc10 77.37,162.52 1.24,149.09 arc80 0,147.62 0,130.66 arc100 1.76,129.19 75.74,134.61 arc-100 77.5,133.13 77.5,58.16 arc-45 77.06,57.1
Copper layers (1*2+15*16): Top 0.035mm / dielectric 0.35mm / Route2 0.035mm / dielectric 0.71mm / Route15 0.035mm / dielectric 0.35mm / Bottom 0.035mm
Design rules "default *": minimum track width 10mil, minimum drill 24mil, track to track 8mil, track to pad 8mil, pad to pad 8mil, via to via 8mil, smd to smd 8mil, copper to edge 40mil, drill to drill 8mil, minimum pad ring 10mil, minimum via ring 8mil, stop-mask expansion 4mil, vias tented up to drill 0mil, thermal gap 10mil
Holes 3.2 mm at 12.54,2.54 12.54,25.4 12.54,16.51 182.72,39.37 182.72,24.13 182.72,16.51 182.72,2.54 12.54,39.37 17.62,6.35 177.64,6.35

### Footprints (pad centres in the part's own frame; a part is rotated, then mirrored left to right if it is on the bottom)
GOLDKONTAKT3MM = drill 3.5 pad 6: 1 0,0
153CLV-1010 = smd 4 x 2.5: + 4,0; - -4,0
153CLV-0807 = smd 4 x 1.6: + 3.05,0; - -3.05,0
C0805 = smd 1.3 x 1.5: 1 -0.95,0; 2 0.95,0
C1210 = smd 1.6 x 2.7: 1 -1.4,0; 2 1.4,0
SMB = smd 2.4 x 2.4: A 2.2,0; C -2.2,0
TQFP32-08 = smd 1.27 x 0.559: 1 -4.293,2.8; 2 -4.293,2; 3 -4.293,1.2; 4 -4.293,0.4; 5 -4.293,-0.4; 6 -4.293,-1.2; 7 -4.293,-2; 8 -4.293,-2.8; 17 4.293,-2.8; 18 4.293,-2; 19 4.293,-1.2; 20 4.293,-0.4; 21 4.293,0.4; 22 4.293,1.2; 23 4.293,2; 24 4.293,2.8 | smd 0.559 x 1.27: 9 -2.8,-4.293; 10 -2,-4.293; 11 -1.2,-4.293; 12 -0.4,-4.293; 13 0.4,-4.293; 14 1.2,-4.293; 15 2,-4.293; 16 2.8,-4.293; 25 2.8,4.293; 26 2,4.293; 27 1.2,4.293; 28 0.4,4.293; 29 -0.4,4.293; 30 -1.2,4.293; 31 -2,4.293; 32 -2.8,4.293
TQFP64 = smd 1.194 x 0.559: 1 -7.8,6; 2 -7.8,5.2; 3 -7.8,4.4; 4 -7.8,3.6; 5 -7.8,2.8; 6 -7.8,2; 7 -7.8,1.2; 8 -7.8,0.4; 9 -7.8,-0.4; 10 -7.8,-1.2; 11 -7.8,-2; 12 -7.8,-2.8; 13 -7.8,-3.6; 14 -7.8,-4.4; 15 -7.8,-5.2; 16 -7.8,-6; 33 7.8,-6; 34 7.8,-5.2; 35 7.8,-4.4; 36 7.8,-3.6; 37 7.8,-2.8; 38 7.8,-2; 39 7.8,-1.2; 40 7.8,-0.4; 41 7.8,0.4; 42 7.8,1.2; 43 7.8,2; 44 7.8,2.8; 45 7.8,3.6; 46 7.8,4.4; 47 7.8,5.2; 48 7.8,6 | smd 0.559 x 1.194: 17 -6,-7.8; 18 -5.2,-7.8; 19 -4.4,-7.8; 20 -3.6,-7.8; 21 -2.8,-7.8; 22 -2,-7.8; 23 -1.2,-7.8; 24 -0.4,-7.8; 25 0.4,-7.8; 26 1.2,-7.8; 27 2,-7.8; 28 2.8,-7.8; 29 3.6,-7.8; 30 4.4,-7.8; 31 5.2,-7.8; 32 6,-7.8; 49 6,7.8; 50 5.2,7.8; 51 4.4,7.8; 52 3.6,7.8; 53 2.8,7.8; 54 2,7.8; 55 1.2,7.8; 56 0.4,7.8; 57 -0.4,7.8; 58 -1.2,7.8; 59 -2,7.8; 60 -2.8,7.8; 61 -3.6,7.8; 62 -4.4,7.8; 63 -5.2,7.8; 64 -6,7.8
TO263-5 = smd 1.067 x 2.159: 1 -3.404,-5.791; 2 -1.702,-5.791; 3 0,-5.791; 4 1.702,-5.791; 5 3.404,-5.791 | smd 10.8 x 10.41: 6 0,2.54
MSS7341 = smd 0.5 x 0.5: 1 0,3.225; 2 0,-3.225
CHIPLED_0805 = smd 1.2 x 1.2: A 0,-1.05; C 0,1.05
KA-3528ASYC = smd 1.5 x 2.2: A -1.55,0; C 1.55,0
CHIP-LED0805 = smd 1.2 x 1.2: A 0,-1.05; C 0,1.05
HC49U-V = drill 0.813: 1 -2.413,0; 2 2.413,0
R0805 = smd 1.3 x 1.5: 1 -0.95,0; 2 0.95,0
SOT23 = smd 1 x 1.4: 1 -0.95,-1.1; 2 0.95,-1.1; 3 0,1.1
SO8 = smd 0.72 x 1.78: 1 -1.27,-2.34; 2 0,-2.34; 3 1.27,-2.34; 4 2.54,-2.34; 5 2.54,2.34; 6# 1.27,2.34; 7 0,2.34; 8 -1.27,2.34

### Placement (x,y rotation side)
1_A  45.48,21.51 0 top
1_B  34.05,21.51 0 top
1_C  22.62,21.51 0 top
2_A  171.91,21.4 180 top
2_B  160.23,21.4 180 top
2_C  149,21.4 180 top
C1  84.93,112.5 0 top
C2  99.06,132.27 0 top
C3  95.83,96.65 180 top
C4  100.26,63.47 0 top
C5  100.26,60.93 0 top
C6  100.26,58.39 0 top
C7  107.02,55.88 180 top
C8  107.04,58.39 180 top
C9  107.02,53.35 180 top
C10  55.72,-10.16 270 bottom  (outside the outline)
C11  60.8,-10.16 270 bottom  (outside the outline)
C12  65.88,-10.16 270 bottom  (outside the outline)
C13  57.27,35.31 135 top
C14  58.81,36.89 315 top
C15  68.79,33.17 315 top
C16  67,31.38 315 top
C17  65.2,29.58 315 top
C18  67.73,9.66 45 top
C19  65.93,11.45 45 top
C20  64.14,13.25 45 top
C21  28.34,21.51 270 top
C22  39.77,21.51 270 top
C23  51.2,21.51 270 top
C24  137.96,7.44 315 top
C25  136.26,5.81 135 top
C26  130.65,29.95 225 top
C27  128.85,31.75 225 top
C28  127.06,33.55 225 top
C29  126.47,10.53 135 top
C30  128.26,12.33 135 top
C31  130.06,14.12 135 top
C32  143.16,21.43 90 top
C33  154.57,21.2 90 top
C34  166.1,21.42 90 top
C35  85.98,33.61 225 top
C36  84.4,35.19 45 top
C37  153.51,-29.21 180 bottom  (outside the outline)
C38  159.86,-29.21 180 bottom  (outside the outline)
C39  166.21,-29.21 180 bottom  (outside the outline)
D1  99.98,124.46 90 top
D2  95.09,104.14 270 top
GND  107.79,114.3 0 top
IC1  130.65,21.62 90 top
IC2  97.63,46.99 315 top
IC3  107.98,103.4 270 top
IC4  63.62,21.43 270 top
IC5  87.28,125.2 90 top
L1  107.79,126.81 180 top
L2  87.5,101.76 0 top
LED1  109.22,140.23 0 top
LED2  86.08,88.43 180 top
LED3  26.51,143.51 270 bottom
LED4  54.45,147.32 270 bottom
LED5  82.39,151.13 270 bottom
LED6  112.87,151.13 270 bottom
LED7  140.81,147.32 270 bottom
LED8  168.75,143.51 270 bottom
LED9  34.13,137.16 0 top
LED10  62.07,140.97 0 top
LED11  90.01,144.78 0 top
LED12  105.25,144.78 0 top
LED13  133.19,140.97 0 top
LED14  161.13,137.16 0 top
PH1  30.32,143.51 270 bottom
PH2  58.26,147.32 270 bottom
PH3  86.2,151.13 270 bottom
PH4  109.06,151.13 270 bottom
PH5  137,147.32 270 bottom
PH6  164.94,143.51 270 bottom
Q1  59.87,31.18 45 top
Q2  134.46,11.46 225 top
Q3  88.74,38.1 135 top
R1  41.67,32.62 0 top
R2  47.7,9.13 90 top
R3  30.24,32.62 0 top
R4  36.27,9.13 90 top
R5  18.81,32.62 0 top
R6  24.84,9.13 90 top
R7  38.5,37.39 90 top
R8  46.12,4.37 270 top
R9  27.07,37.39 90 top
R10  34.69,4.37 270 top
R11  15.64,37.39 90 top
R12  23.26,4.37 270 top
R13  71.86,25.21 90 top
R14  123.03,25.43 90 top
R15  173.8,8.85 90 top
R16  169.72,33.63 270 top
R17  162.4,8.95 90 top
R18  158.21,33.68 270 top
R19  150.88,8.9 90 top
R20  146.88,33.74 270 top
R21  170.02,5.11 270 top
R22  168.09,38.18 90 top
R23  157.32,5.11 270 top
R24  156.76,38.12 90 top
R25  145.89,5.11 270 top
R26  145.21,38.13 90 top
R27  105.25,136.11 270 top
R28  105.25,140.26 270 top
R29  26.51,148.59 90 bottom
R30  89.74,92.56 90 top
R31  89.74,88.44 90 top
R32  54.45,152.4 90 bottom
R33  84.16,46.07 135 top
R34  109.22,136.05 270 top
R35  86.18,92.57 90 top
R36  82.39,156.21 90 bottom
R37  112.87,156.21 90 bottom
R38  140.81,152.4 90 bottom
R39  168.75,148.59 90 bottom
R40  30.32,148.59 90 bottom
R41  58.26,152.4 90 bottom
R42  86.2,156.21 90 bottom
R43  109.06,156.21 90 bottom
R44  137,152.4 90 bottom
R45  164.94,148.59 90 bottom
R46  30.32,138.43 90 bottom
R47  58.26,142.24 90 bottom
R48  86.2,146.05 90 bottom
R49  109.06,146.05 90 bottom
R50  137,142.24 90 bottom
R51  164.94,138.43 90 bottom
R52  34.13,140.97 270 top
R53  62.07,144.78 270 top
R54  90.01,148.59 270 top
R55  105.25,148.59 270 top
R56  133.19,144.78 270 top
R57  161.13,140.97 270 top
R58  10,-10.16 270 bottom  (outside the outline)
R59  15.08,-10.16 270 bottom  (outside the outline)
R60  20.16,-10.16 270 bottom  (outside the outline)
R61  25.24,-10.16 270 bottom  (outside the outline)
R62  30.32,-10.16 270 bottom  (outside the outline)
R63  35.4,-10.16 270 bottom  (outside the outline)
R64  40.48,-10.16 270 bottom  (outside the outline)
R65  45.56,-10.16 270 bottom  (outside the outline)
R66  50.64,-10.16 270 bottom  (outside the outline)
R67  153.51,-22.86 180 bottom  (outside the outline)
R68  158.59,-22.86 180 bottom  (outside the outline)
R69  163.67,-22.86 180 bottom  (outside the outline)
R70  168.75,-22.86 180 bottom  (outside the outline)
R71  153.51,-16.51 180 bottom  (outside the outline)
R72  158.59,-16.51 180 bottom  (outside the outline)
R73  163.67,-16.51 180 bottom  (outside the outline)
R74  168.75,-16.51 180 bottom  (outside the outline)
R75  153.51,-10.16 180 bottom  (outside the outline)
T1  173.83,5.11 0 top
T2  171.29,38.13 180 top
T3  161.13,5.11 0 top
T4  159.86,38.13 180 top
T5  148.43,38.13 180 top
T6  149.7,5.11 0 top
T13  42.31,37.39 180 top
T14  49.93,4.37 0 top
T15  30.88,37.39 180 top
T16  38.5,4.37 0 top
T17  27.07,4.37 0 top
T18  19.45,37.39 180 top
U2  46.12,28.5 180 top
U3  34.69,28.5 180 top
U4  23.26,28.5 180 top
U5  44.85,14.53 0 top
U6  33.42,14.53 0 top
U7  21.99,14.53 0 top
U8  171.29,14.19 0 top
U9  159.83,14.19 0 top
U10  148.37,14.19 0 top
U11  172.56,28.34 180 top
U12  161.02,28.34 180 top
U13  149.56,28.34 180 top
VCC  98.9,114.3 90 top

### Tracks (layer width: path | path; a pad name or v marks a point on that pad's centre or on a via)
1_A  (1 unrouted)
  pour Top (no thermals): 43.26,15.8 47.7,15.8 47.7,18.34 48.66,19.29 48.66,23.73 47.7,24.69 47.7,27.23 43.26,27.23 43.26,24.69 42.31,23.73 42.31,19.61 43.26,18.65
1_A_EMF  (3 unrouted)
1_B  (1 unrouted)
  pour Top (no thermals): 31.83,15.8 36.27,15.8 36.27,18.34 37.23,19.29 37.23,23.73 36.27,24.69 36.27,27.23 31.83,27.23 31.83,24.69 30.88,23.73 30.88,19.61 31.83,18.65
1_B_EMF  (3 unrouted)
1_C  (1 unrouted)
  pour Top (no thermals): 20.4,15.8 24.84,15.8 24.84,18.34 25.8,19.29 25.8,23.73 24.84,24.69 24.84,27.23 20.4,27.23 20.4,24.69 19.45,23.73 19.45,19.61 20.4,18.65
1_C_EMF  (3 unrouted)
1_DIR  (via drill 0.8 pad 1.42)
  Top 0.406: IC4.31 69.12,23.43 v69.69,23.42 | v74.77,25.4 83.66,25.4 93.63,35.37 93.63,37.9 IC2.29
  Bottom 0.406: v69.69,23.42 72.79,23.42 v74.77,25.4
1_MITTEL  (2 unrouted)
1_N1
  Top 0.5: T14.1 48.98,2.2 49.38,1.8 51.91,1.8 54.82,4.71 54.82,17.41 56.85,19.43 IC4.15
1_N2
  Top 0.5: T16.1 37.55,1.66 38.13,1.08 52.47,1.08 55.51,4.13 55.51,16.83 57.32,18.63 IC4.16
1_N3
  Top 0.5: T17.1 26.12,1.84 27.65,0.31 53.09,0.31 56.25,3.47 56.25,11.22 60.82,15.79 IC4.17
1_P1
  Top 0.5: T13.1 43.26,39.33 43.62,39.69 47.78,39.69 51.01,36.46 51.01,32.65 53.55,30.11 53.55,22.49 55.81,20.23 IC4.14
1_P2
  Top 0.5: T15.1 31.83,39.6 32.66,40.43 48.45,40.43 51.79,37.09 51.79,33 54.39,30.4 54.39,22.92 56.28,21.03 IC4.13
1_P3
  Top 0.5: T18.1 20.4,39.61 21.99,41.2 49,41.2 52.65,37.54 52.65,33.55 55.19,31.01 55.19,23.39 56.74,21.83 IC4.12
1_STP  (via drill 0.8 pad 1.42)
  Top 0.406: IC4.32 68.53,24.23 v69.69,25.4 | v74.77,27.94 84.93,27.94 92.92,35.93 92.92,38.32 IC2.28
  Bottom 0.406: v69.69,25.4 72.23,25.4 v74.77,27.94
2_A  (1 unrouted)
  pour Top (no thermals): 173.96,27.04 169.52,27.04 169.52,24.5 168.56,23.55 168.56,19.1 169.52,18.15 169.52,15.61 173.96,15.61 173.96,18.15 174.91,19.1 174.91,23.23 173.96,24.18
2_A_EMF  (3 unrouted)
2_B  (1 unrouted)
  pour Top (no thermals): 162.53,27.04 158.09,27.04 158.09,24.5 157.13,23.55 157.13,19.1 158.09,18.15 158.09,15.61 162.53,15.61 162.53,18.15 163.48,19.1 163.48,23.23 162.53,24.18
2_B_EMF  (3 unrouted)
2_C  (1 unrouted)
  pour Top (no thermals): 151.1,27.04 146.66,27.04 146.66,24.5 145.7,23.55 145.7,19.1 146.66,18.15 146.66,15.61 151.1,15.61 151.1,18.15 152.05,19.1 152.05,23.23 151.1,24.18
2_C_EMF  (3 unrouted)
2_DIR
  Top 0.406: IC1.31 107.22,19.62 95.09,31.75 95.09,37.1 IC2.31
2_MITTEL  (2 unrouted)
2_N1  (1 unrouted)
2_N2  (1 unrouted)
2_N3  (1 unrouted)
2_P1  (1 unrouted)
2_P2  (1 unrouted)
2_P3  (1 unrouted)
2_STP
  Top 0.406: IC1.32 106.75,18.82 94.38,31.19 94.38,37.52 IC2.30
3V3_FEEDBACK
  Top 0.5: R31.2 R30.1 91.45,91.61 93.82,93.98 101.44,93.98 102.71,95.25 102.71,97.79 103.98,99.06 103.98,101.6 102.28,101.6 IC3.4
5V_FEEDBACK
  Top 0.5: R28.2 R27.1 103.88,137.06 101.44,134.62 93.82,134.62 92.55,133.35 92.55,130.81 91.28,129.54 91.28,127 92.98,127 IC5.4
+3V3  (via drill 0.8 pad 1.42)  (1 unrouted)
  Top 0.406: R33.2 83.49,46.81 | v79.84,59.68 v79.85,59.69
  Top 0.5: 83.49,46.81 79.84,50.46 v79.84,59.68 | R33.2 83.49,46.68 83,46.19 83,45.11 85.82,42.29 88.94,42.29 90.11,43.45 IC2.21 90.14,43.48 91.73,45.08 91.73,49.57 IC2.64 99.31,57.16 C6.1 C5.1 99.37,60.99 99.37,63.53 C4.1 99.31,64.85 99.91,65.45 102.07,65.45 102.71,64.81 102.71,60.96 103.62,60.05 107.29,60.05 107.99,59.35 C8.1 107.99,55.9 C7.1 C9.1 107.97,52.25 IC2.52
  other vias: 79.85,64.77 79.85,62.23 86.2,97.79 88.74,97.79 88.74,95.25 86.2,95.25 84.93,96.52 87.47,96.52
  pour Top (no thermals): 95.17,97.11 91.64,100.64 84.03,100.64 84.03,95.44 85.33,94.14 85.33,93.02 90.71,93.02 93.31,95.62 95.17,95.62
  pour Bottom (no thermals): 89.27,99.06 89.27,93.98 81.12,93.98 81.12,58.42 78.58,58.42 78.58,99.06
  pour Bottom (no thermals): 25.79,149.1 44.55,149.1 48.26,152.81 68.14,152.81 72.04,156.71 124.61,156.71 128.51,152.81 151.73,152.81 155.63,148.91 169.93,148.91 169.93,153 117.36,162.28 77.61,162.28 25.79,153
+5V  (via drill 0.8 pad 1.42)  (3 unrouted)
  Top 0.406: R14.2 123.03,26.67 v124.3,27.94 | L1.2 109.06,130.04 v109.06,132.08 105.25,132.08 v105.25,133.35
  Top 0.5: C18.1 C19.1 C20.1 61.63,14.42 IC4.18 61.62,20.06 62.42,20.86 IC4.6 | C17.1 C16.1 C15.1 | C29.1 C30.1 C31.1 131.85,14.57 IC1.6 131.85,21.3 132.65,22.1 IC1.18 v132.65,27.94 132.65,29.3 C26.1 C27.1 C28.1 | R13.2 71.86,27.04 v70.96,27.94 | v63.34,27.94 63.34,29.21
  Bottom 0.406: v124.3,27.94 v132.65,27.94
  Bottom 0.5: v70.96,27.94 v63.34,27.94
  other vias: 106.52,132.08 107.79,133.35 110.33,133.35 107.79,130.81 110.33,130.81 105.25,130.81
  pour Top (no thermals): 62.38,25.2 64.05,25.2 64.05,29.1 65.35,30.4 64.61,31.15 62.38,28.92
  pour Top (no thermals): 100.09,131.49 103.62,127.96 111.23,127.96 111.23,133.16 109.93,134.46 109.93,135.58 104.55,135.58 101.95,132.98 100.09,132.98
GND  (via drill 0.8 pad 1.42)  (29 unrouted)
  Top 0.406: LED1.C 109.06,141.28 R49.1 111.6,145.1 v111.6,146.05
  Top 0.5: C18.2 C19.2 C20.2 64.02,14.65 IC4.21 64.04,17.16 64.04,20.12 | IC4.5 63.22,20.93 64.04,20.12 | 64.04,20.12 64.82,20.9 IC4.3 64.82,27.86 C17.2 C16.2 C15.2 | T17.2 28.02,3.47 28.95,4.4 28.95,10.69 v28.97,10.72 | T16.2 39.45,3.38 40.46,4.4 40.46,10.66 v40.4,10.72 | T14.2 50.88,3.48 51.79,4.4 51.79,13.93 v51.2,14.53 | C13.2 56.6,36.02 C14.1 | C25.1 137.01,5.14 C24.2 | C31.2 C30.2 C29.2 | C28.2 C27.2 C26.2 130.25,29.01 IC1.21 130.25,22.1 | IC1.3 129.45,21.3 130.25,22.1 | 130.25,22.1 130.25,21.99 131.05,21.19 IC1.5 | C35.2 C36.1 83.72,34.52 83.19,35.05 83.19,36.36 84.93,38.1 84.93,39.37 86.92,41.36 89.13,41.36 90.66,42.89 IC2.22 90.7,42.93 92.66,44.89 | 92.66,44.89 92.66,49.37 IC2.63 101.21,57.92 C6.2 C5.2 C4.2 | IC2.53 105.12,50.48 | 92.66,44.89 99.49,44.89 IC2.53 | R28.1 109.15,141.21 LED1.C | R31.1 86.19,87.49 LED2.C | C9.2 C7.2 106.09,55.9 C8.2 106.09,51.49 IC2.53
  other vias: 28.34,17.07 27.07,15.8 29.61,15.8 28.34,14.53 39.77,17.07 39.77,14.53 38.5,15.8 41.04,15.8 51.2,17.07 49.93,15.8 32.15,10.72 34.05,10.72 43.58,10.72 45.48,10.72 22.62,10.72 20.72,10.72 18.81,10.72 40.28,38.58 28.85,38.58 17.42,38.58 175.55,32.12 173.64,32.12 171.74,32.12 165.39,32.12 162.21,32.12 160.31,32.12 153.96,32.12 150.78,32.12 148.88,32.12 143.16,25.77 143.16,28.31 144.43,27.04 155.86,27.04 167.29,27.04 154.59,28.31 166.02,28.31 166.02,25.77 154.59,25.77 153.32,27.04 164.75,27.04 95.09,129.54 96.36,128.27 97.63,127 96.36,125.73 97.63,129.54 100.17,99.06 98.9,100.33 97.63,101.6 98.9,102.87 97.63,99.06 98.9,97.79 83.66,115.57 84.93,114.3 86.2,115.57 84.93,116.84 26.51,139.7 27.78,138.43 54.45,143.51 55.72,142.24 82.39,147.32 83.66,146.05 112.87,147.32 139.54,142.24 140.81,143.51 167.48,138.43 168.75,139.7
  pour Top (no thermals): 27.07,20.88 27.07,17.7 26.11,16.75 26.11,9.45 34.82,9.45 34.82,13.89 30.56,13.89 30.56,16.75 29.61,17.7 29.61,20.88
  pour Top (no thermals): 49.93,20.88 49.93,17.7 48.97,16.75 48.97,9.45 53.42,9.45 53.42,16.75 52.47,17.7 52.47,20.88
  pour Top (no thermals): 38.5,20.88 38.5,17.7 37.54,16.75 37.54,9.45 46.25,9.45 46.25,13.89 41.99,13.89 41.99,16.75 41.04,17.7 41.04,20.88
  pour Top (no thermals): 17.86,13.89 17.86,9.45 23.39,9.45 23.39,13.89
  pour Bottom (no thermals): 11.51,18.02 11.51,8.49 53.74,8.49 53.74,18.02
  pour Top (no thermals): 41.86,37.83 40.37,37.83 39.91,38.3 39.91,39.04 41.86,39.04
  pour Top (no thermals): 30.43,37.83 28.94,37.83 28.48,38.3 28.48,39.04 30.43,39.04
  pour Top (no thermals): 19,37.83 17.51,37.83 17.05,38.3 17.05,39.04 19,39.04
  pour Bottom (no thermals): 184.12,24.82 184.12,34.34 140.62,34.34 140.62,24.82
  pour Top (no thermals): 167.29,21.96 167.29,25.14 168.25,26.09 168.25,33.39 159.54,33.39 159.54,28.95 163.8,28.95 163.8,26.09 164.75,25.14 164.75,21.96
  pour Top (no thermals): 155.86,21.96 155.86,25.14 156.82,26.09 156.82,33.39 148.11,33.39 148.11,28.95 152.37,28.95 152.37,26.09 153.32,25.14 153.32,21.96
  pour Top (no thermals): 176.5,28.95 176.5,33.39 170.97,33.39 170.97,28.95
  pour Top (no thermals): 144.43,21.96 144.43,25.14 145.39,26.09 145.39,33.39 140.94,33.39 140.94,26.09 141.89,25.14 141.89,21.96
  pour Top (no thermals): 131.11,18 129.44,18 129.44,15.77 128.51,14.84 129.25,14.1 131.11,15.96
  pour Top (no thermals): 92.29,124.8 98.05,124.8 98.79,125.55 101.02,125.55 101.02,127.96 97.86,131.12 97.86,132.98 94.14,132.98 94.14,129.07 92.29,129.07 92.29,128.15 95.03,128.15 95.09,128.08 95.09,125.56 95.07,125.55 92.29,125.55
  pour Top (no thermals): 102.97,103.8 97.21,103.8 96.47,103.05 94.24,103.05 94.24,100.64 97.4,97.48 97.4,95.62 101.12,95.62 101.12,99.53 102.97,99.53 102.97,100.45 100.23,100.45 100.17,100.52 100.17,103.04 100.19,103.05 102.97,103.05
  pour Bottom (no thermals): 93.96,133.34 93.96,124.8 103.43,115.32 103.43,112.54 96.56,105.67 96.56,95.26 111.08,95.45 111.08,126.99 102.71,127 96.37,133.34
  pour Top (no thermals): 78.91,111.24 78.91,114.58 82.44,118.11 87.46,118.11 87.46,115.51 83.19,111.24
  pour Bottom (no thermals): 82.39,115.57 86.2,119.38 88.74,119.38 95.09,125.73 98.9,121.92 87.47,110.49
  pour Bottom (no thermals): 25.42,142.6 27.65,142.6 27.65,141.3 28.95,140 28.95,138.14 28.95,137.95 30.99,137.95 30.99,136.84 25.42,136.84
  pour Bottom (no thermals): 53.36,146.41 55.59,146.41 55.59,145.11 56.89,143.8 56.89,141.95 56.89,141.76 58.93,141.76 58.93,140.65 53.36,140.65
  pour Bottom (no thermals): 81.3,150.22 83.53,150.22 83.53,148.92 84.83,147.61 84.83,145.76 84.83,145.57 86.87,145.57 86.87,144.46 81.3,144.46
  pour Bottom (no thermals): 113.96,150.22 111.73,150.22 111.73,148.92 110.43,147.61 110.43,145.76 110.43,145.57 108.39,145.57 108.39,144.46 113.96,144.46
  pour Bottom (no thermals): 141.9,146.41 139.67,146.41 139.67,145.11 138.37,143.8 138.37,141.95 138.37,141.76 136.33,141.76 136.33,140.65 141.9,140.65
  pour Bottom (no thermals): 169.84,142.6 167.61,142.6 167.61,141.3 166.31,140 166.31,138.14 166.31,137.95 164.27,137.95 164.27,136.84 169.84,136.84
  pour Top (no thermals): 104.32,110.49 116.68,110.49 116.68,143.51 112.87,143.51 112.87,119.38 104.32,119.38
  pour Top (isolate 0.1, no thermals): 25.24,135.89 44.29,135.89 48.1,139.7 68.42,139.7 72.23,143.51 124.3,143.51 128.11,139.7 152.24,139.7 156.05,135.89 170.02,135.89 170.02,152.4 117.95,161.29 77.31,161.29 25.24,152.4
N$1
  Top 0.5: IC1.8 133.45,15.88 Q2.1 136.17,9.24 C24.1
N$2
  Top 0.5: IC1.7 132.65,9.86 Q2.2 132.75,9.31 C25.2
N$3
  pour Top (no thermals): 43.89,30.08 43.89,32.62 43.26,33.26 41.99,33.26 41.99,31.35 43.26,30.08
N$4
  pour Top (no thermals): 32.46,30.08 32.46,32.62 31.83,33.26 30.56,33.26 30.56,31.35 31.83,30.08
N$5
  pour Top (no thermals): 21.03,30.08 21.03,32.62 20.4,33.26 19.13,33.26 19.13,31.35 20.4,30.08
N$6
  pour Top (no thermals): 24.21,9.63 25.48,9.63 25.48,10.72 24.84,11.35 24.84,12.94 24.21,12.94
N$7
  pour Top (no thermals): 35.64,9.63 36.91,9.63 36.91,10.72 36.27,11.35 36.27,12.94 35.64,12.94
N$8
  pour Top (no thermals): 47.07,9.63 48.34,9.63 48.34,10.72 47.7,11.35 47.7,12.94 47.07,12.94
N$9
  Top 0.5: IC4.8 60.82,26.82 Q1.1 58.16,34.42 C13.1
N$10
  Top 0.5: IC4.7 61.62,32.84 Q1.2 61.57,34.12 C14.2
N$11
  Top 0.5: IC1.29 124.67,21.22 123.03,22.86 R14.1
N$12  (1 unrouted)
N$13
  Top 0.5: IC4.29 71.02,21.83 71.86,22.67 R13.1
N$14  (1 unrouted)
N$15  (1 unrouted)
N$16
  pour Top (no thermals): 147.3,33.15 146.22,33.15 146.22,32.07 146.85,31.44 146.85,29.85 147.3,29.85
N$17
  pour Top (no thermals): 158.73,33.15 157.65,33.15 157.65,32.07 158.28,31.44 158.28,29.85 158.73,29.85
N$18
  pour Top (no thermals): 170.16,33.15 169.08,33.15 169.08,32.07 169.71,31.44 169.71,29.85 170.16,29.85
N$19
  Bottom 0.5: R29.1 LED3.A
N$20
  pour Top (no thermals): 92.01,123.24 92.01,123.8 97.96,123.8 98.33,123.43 102.23,123.43 104.46,125.66 111.33,125.66 111.33,123.43 108.92,121.01 97.4,121.01 95.17,123.24
N$21
  pour Top (no thermals): 103.25,105.36 103.25,104.8 97.3,104.8 96.93,105.17 93.03,105.17 90.8,102.94 83.93,102.94 83.93,105.17 86.34,107.59 97.86,107.59 100.09,105.36
N$22
  Bottom 0.5: R32.1 LED4.A
N$23
  Top 0.5: R33.1 84.9,45.4 87.27,43.03 88.58,43.03 IC2.20
N$24
  Top 0.5: IC2.23 88.75,39.81 Q3.2 87.03,37.82 C36.2
N$25
  Top 0.5: IC2.24 90.45,40.37 Q3.1 88.77,36.39 C35.1
N$76
  Top 0.5: R35.1 86.18,89.58 LED2.A
N$77
  Top 0.5: R34.1 LED1.A
N$78
  Bottom 0.5: R36.1 LED5.A
N$79
  Bottom 0.5: R37.1 LED6.A
N$80
  Bottom 0.5: R38.1 LED7.A
N$81
  Bottom 0.5: R39.1 LED8.A
N$82
  Bottom 0.5: R40.1 PH1.A
N$83
  Bottom 0.5: R41.1 PH2.A
N$84
  Bottom 0.5: R42.1 PH3.A
N$85
  Bottom 0.5: R43.1 PH4.A
N$86
  Bottom 0.5: R44.1 PH5.A
N$87
  Bottom 0.5: R45.1 PH6.A
N$88  (via drill 0.8 pad 1.42)
  other vias: 96.36,130.81
N$89
  Top 0.5: LED9.C R52.2
N$90
  Top 0.5: LED10.C R53.2
N$91
  Top 0.5: LED11.C R54.2
N$92
  Top 0.5: LED12.C R55.2
N$93
  Top 0.5: LED13.C R56.2
N$94
  Top 0.5: LED14.C R57.2
N_1
  pour Top (no thermals): 45.49,4.77 50.32,4.77 50.32,6.81 48.46,8.67 46.98,8.67 45.49,7.18
N_2
  pour Top (no thermals): 34.06,4.77 38.89,4.77 38.89,6.81 37.03,8.67 35.55,8.67 34.06,7.18
N_3
  pour Top (no thermals): 22.63,4.77 27.46,4.77 27.46,6.81 25.6,8.67 24.12,8.67 22.63,7.18
N_4
  pour Top (no thermals): 171.87,37.77 167.41,37.77 167.41,35.91 169.08,34.24 170.57,34.24 171.87,35.54
N_5
  pour Top (no thermals): 160.44,37.77 155.98,37.77 155.98,35.91 157.65,34.24 159.14,34.24 160.44,35.54
N_6
  pour Top (no thermals): 149.01,37.77 144.55,37.77 144.55,35.91 146.22,34.24 147.71,34.24 149.01,35.54
P_1
  pour Top (no thermals): 37.88,37.09 42.89,37.09 42.89,35.6 41.22,33.93 41.22,31.89 40.1,31.89 40.1,33.75 37.88,35.98
P_2
  pour Top (no thermals): 26.45,37.09 31.46,37.09 31.46,35.6 29.79,33.93 29.79,31.89 28.67,31.89 28.67,33.75 26.45,35.98
P_3
  pour Top (no thermals): 15.02,37.09 20.03,37.09 20.03,35.6 18.36,33.93 18.36,31.89 17.24,31.89 17.24,33.75 15.02,35.98
P_4  (2 unrouted)
P_5  (2 unrouted)
P_6  (2 unrouted)
SENSE1  (via drill 0.8 pad 1.42)
  Top 0.5: IC2.49 107.39,48.29 109.56,50.46 109.56,59.1 108.26,60.4 108.26,89.47 v109.06,90.27
  Bottom 0.5: PH1.C R46.2 30.32,140.44 30.43,140.55 39.63,140.55 40.48,139.7 69.7,139.7 70.37,140.37 110.86,140.37 111.98,139.25 111.98,93.19 v109.06,90.27
SENSE2  (via drill 0.8 pad 1.42)
  Top 0.5: IC2.48 110.02,45.72 110.49,46.19 110.49,59.47 109.19,60.77 109.19,87.76 v111.6,90.17
  Bottom 0.5: PH2.C 58.26,144.27 | 58.26,144.27 R47.2 | v111.6,90.17 112.87,91.44 112.87,139.66 111.23,141.29 70.37,141.29 67.21,144.45 58.45,144.45 58.26,144.27
SENSE3  (via drill 0.8 pad 1.42)
  Top 0.5: IC2.47 106.89,45.15 107.33,44.7 110.49,44.7 111.42,45.63 111.42,59.85 110.12,61.15 110.12,86.13 v111.61,87.61
  Bottom 0.5: PH3.C 86.2,147.98 | 86.2,147.98 R48.2 | v111.61,87.61 113.83,89.84 113.83,140.01 111.6,142.24 99.33,142.24 93.4,148.17 86.39,148.17 86.2,147.98
SENSE4  (via drill 0.8 pad 1.42)
  Top 0.5: IC2.46 106.34,44.59 107.15,43.78 110.86,43.78 112.35,45.26 112.35,60.22 111.05,61.52 111.05,84.54 v114.14,87.63
  Bottom 0.5: PH4.C 109.06,148.17 | 109.06,148.17 R49.2 | v114.14,87.63 114.14,87.73 114.76,88.36 114.76,140.37 111.98,143.15 108.08,143.15 106.96,144.27 106.96,147.42 107.7,148.17 109.06,148.17
SENSE5  (via drill 0.8 pad 1.42)
  Top 0.5: IC2.45 105.79,44.02 106.96,42.85 111.23,42.85 113.28,44.89 113.28,60.59 111.98,61.89 111.98,82.78 v114.21,85.01
  Bottom 0.5: PH5.C 137,144.27 | 137,144.27 R50.2 | v114.21,85.01 115.69,86.5 115.69,139.62 120.52,144.45 136.81,144.45 137,144.27
SENSE6  (via drill 0.8 pad 1.42)
  Top 0.5: IC2.44 105.12,43.38 106.59,41.92 111.61,41.92 114.14,44.45 114.14,60.96 112.87,62.23 112.87,81.28 v116.68,85.09
  Bottom 0.5: PH6.C 164.94,140.55 | 164.94,140.55 R51.2 | v116.68,85.09 116.68,138.43 119.22,140.97 130.65,140.97 131.92,139.7 147.35,139.7 148.38,140.74 164.75,140.74 164.94,140.55
V+  (via drill 0.8 pad 1.42)  (12 unrouted)
  Top 0.5: R9.2 25.48,38.34 24.53,37.39 U4.1 | R7.2 36.91,38.34 35.96,37.39 U3.1
  other vias: 26.43,28.81 28.34,29.77 28.34,27.54 26.43,31.04 37.86,31.04 37.86,28.81 39.77,27.54 39.77,29.77 51.2,29.77 51.2,27.54 49.29,28.81 49.29,31.04 22.62,32.62 34.05,32.62 45.48,32.62 35.96,32.62 24.53,32.62 171.74,10.21 160.31,10.21 148.88,10.21 169.83,10.21 158.4,10.21 146.97,10.21 167.93,11.8 166.02,13.07 167.93,14.02 166.02,15.29 156.5,11.8 145.07,11.8 154.59,13.07 143.16,13.07 156.5,14.02 145.07,14.02 154.59,15.29 143.16,15.29 21.25,2.89 32.68,2.89 44.11,2.89
  pour Top (no thermals): 27.07,22.15 27.07,26.59 25.16,28.5 21.86,28.5 21.86,33.58 25.8,33.58 29.61,29.77 29.61,22.15
  pour Top (no thermals): 38.5,22.15 38.5,26.59 36.59,28.5 33.29,28.5 33.29,33.58 37.23,33.58 41.04,29.77 41.04,22.15
  pour Top (no thermals): 49.93,22.15 49.93,26.59 48.02,28.5 44.72,28.5 44.72,33.58 48.66,33.58 52.47,29.77 52.47,22.15
  pour Bottom (no thermals): 11.51,34.53 11.51,25 53.74,25 53.74,34.53
  pour Bottom (no thermals): 184.12,8.31 184.12,17.83 140.62,17.83 140.62,8.31
  pour Top (no thermals): 144.43,20.69 144.43,16.25 146.34,14.34 149.65,14.34 149.65,9.26 145.7,9.26 141.89,13.07 141.89,20.69
  pour Top (no thermals): 155.86,20.69 155.86,16.25 157.77,14.34 161.08,14.34 161.08,9.26 157.13,9.26 153.32,13.07 153.32,20.69
  pour Top (no thermals): 167.29,20.69 167.29,16.25 169.2,14.34 172.51,14.34 172.51,9.26 168.56,9.26 164.75,13.07 164.75,20.69
  pour Top (no thermals): 23.93,4.03 20.22,4.03 20.22,1.8 21.7,1.8 22.63,2.73 23.93,2.73
  pour Top (no thermals): 35.36,4.03 31.65,4.03 31.65,1.8 33.13,1.8 34.06,2.73 35.36,2.73
  pour Top (no thermals): 46.79,4.03 43.08,4.03 43.08,1.8 44.56,1.8 45.49,2.73 46.79,2.73
  pour Top (no thermals): 86.9,111.24 90.8,111.24 93.19,108.85 98.6,108.82 101.02,106.41 103.25,106.41 103.25,115.14 98.97,119.41 97.12,119.41 94.33,122.2 92.1,122.2 92.1,118.67 86.9,113.47

### Text on the board
tPlace: 3S LIPO 11.1V | V- | V+ | LineBot | CPE Projekt 2015/16 / 4.ET HTL Saalfelden | Matthias Kapeller, Felix Haussteiner | Motor Links
tNames: Versorgung 5V | Versorgung 3V3